# EAGLE design UltrasonicMatrix (EAGLE 9.4.2)
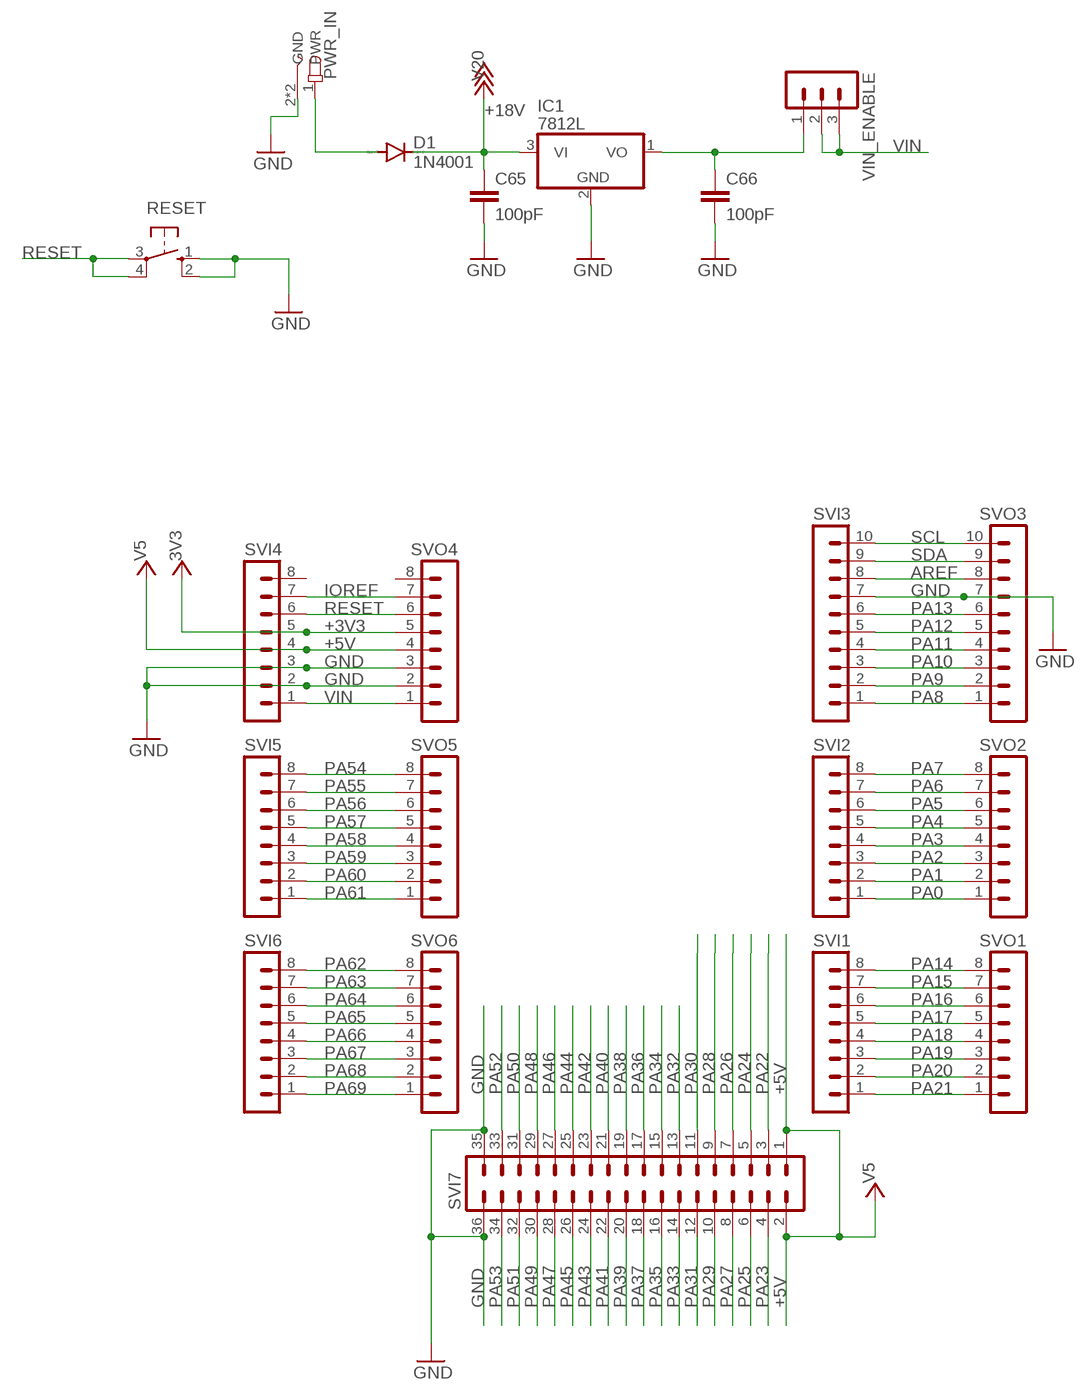
[diagram p0: schematic, sheet 1, part 1 of 2]
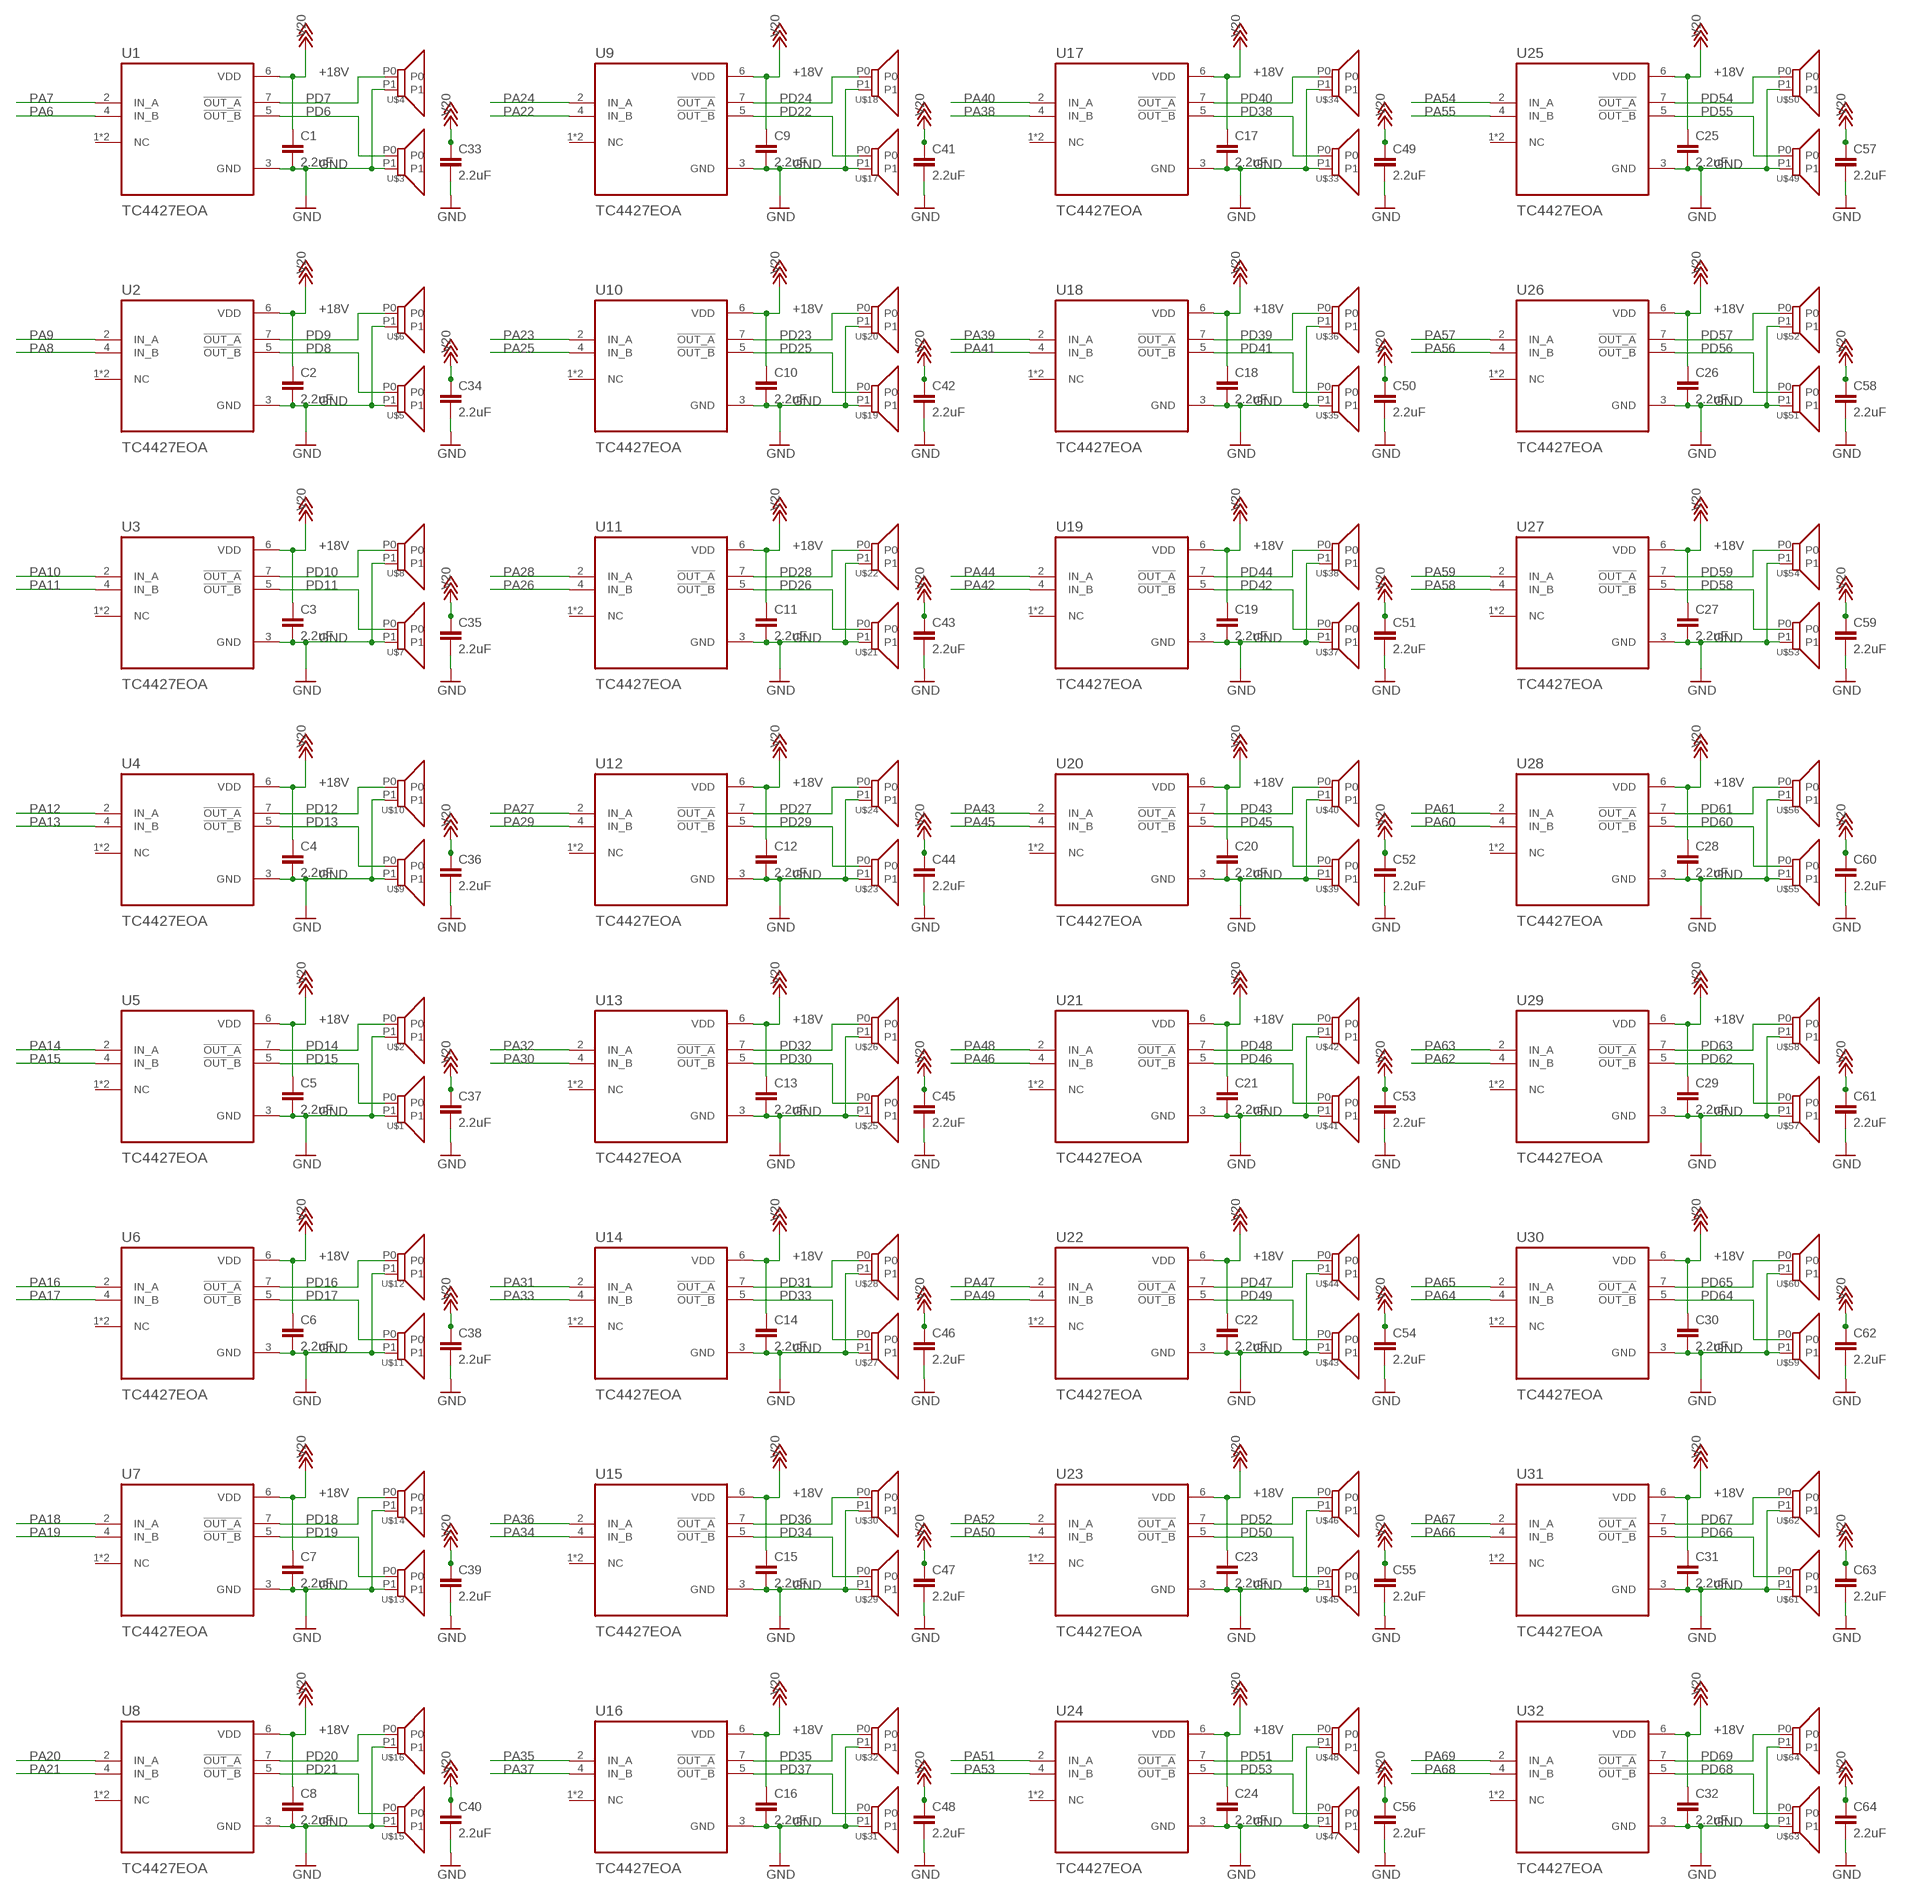
[diagram p1: schematic, sheet 1, part 2 of 2]

## Parts
C1  2.2uF  C-EUC1206  [C1206]
C2  2.2uF  C-EUC1206  [C1206]
C3  2.2uF  C-EUC1206  [C1206]
C4  2.2uF  C-EUC1206  [C1206]
C5  2.2uF  C-EUC1206  [C1206]
C6  2.2uF  C-EUC1206  [C1206]
C7  2.2uF  C-EUC1206  [C1206]
C8  2.2uF  C-EUC1206  [C1206]
C9  2.2uF  C-EUC1206  [C1206]
C10  2.2uF  C-EUC1206  [C1206]
C11  2.2uF  C-EUC1206  [C1206]
C12  2.2uF  C-EUC1206  [C1206]
C13  2.2uF  C-EUC1206  [C1206]
C14  2.2uF  C-EUC1206  [C1206]
C15  2.2uF  C-EUC1206  [C1206]
C16  2.2uF  C-EUC1206  [C1206]
C17  2.2uF  C-EUC1206  [C1206]
C18  2.2uF  C-EUC1206  [C1206]
C19  2.2uF  C-EUC1206  [C1206]
C20  2.2uF  C-EUC1206  [C1206]
C21  2.2uF  C-EUC1206  [C1206]
C22  2.2uF  C-EUC1206  [C1206]
C23  2.2uF  C-EUC1206  [C1206]
C24  2.2uF  C-EUC1206  [C1206]
C25  2.2uF  C-EUC1206  [C1206]
C26  2.2uF  C-EUC1206  [C1206]
C27  2.2uF  C-EUC1206  [C1206]
C28  2.2uF  C-EUC1206  [C1206]
C29  2.2uF  C-EUC1206  [C1206]
C30  2.2uF  C-EUC1206  [C1206]
C31  2.2uF  C-EUC1206  [C1206]
C32  2.2uF  C-EUC1206  [C1206]
C33  2.2uF  C-EUC1206  [C1206]
C34  2.2uF  C-EUC1206  [C1206]
C35  2.2uF  C-EUC1206  [C1206]
C36  2.2uF  C-EUC1206  [C1206]
C37  2.2uF  C-EUC1206  [C1206]
C38  2.2uF  C-EUC1206  [C1206]
C39  2.2uF  C-EUC1206  [C1206]
C40  2.2uF  C-EUC1206  [C1206]
C41  2.2uF  C-EUC1206  [C1206]
C42  2.2uF  C-EUC1206  [C1206]
C43  2.2uF  C-EUC1206  [C1206]
C44  2.2uF  C-EUC1206  [C1206]
C45  2.2uF  C-EUC1206  [C1206]
C46  2.2uF  C-EUC1206  [C1206]
C47  2.2uF  C-EUC1206  [C1206]
C48  2.2uF  C-EUC1206  [C1206]
C49  2.2uF  C-EUC1206  [C1206]
C50  2.2uF  C-EUC1206  [C1206]
C51  2.2uF  C-EUC1206  [C1206]
C52  2.2uF  C-EUC1206  [C1206]
C53  2.2uF  C-EUC1206  [C1206]
C54  2.2uF  C-EUC1206  [C1206]
C55  2.2uF  C-EUC1206  [C1206]
C56  2.2uF  C-EUC1206  [C1206]
C57  2.2uF  C-EUC1206  [C1206]
C58  2.2uF  C-EUC1206  [C1206]
C59  2.2uF  C-EUC1206  [C1206]
C60  2.2uF  C-EUC1206  [C1206]
C61  2.2uF  C-EUC1206  [C1206]
C62  2.2uF  C-EUC1206  [C1206]
C63  2.2uF  C-EUC1206  [C1206]
C64  2.2uF  C-EUC1206  [C1206]
C65  100pF  C-EU050-025X075  [C050-025X075]
C66  100pF  C-EU050-025X075  [C050-025X075]
D1  1N4001  1N4004  [DO41-10]
IC1  7812L  [TO92]
PWR_IN  DCJACK  [DCJACK]
RESET  10-XX  [B3F-10XX]
SVI1  MA08-1  [MA08-1]
SVI2  MA08-1  [MA08-1]
SVI3  MA10-1  [MA10-1]
SVI4  MA08-1  [MA08-1]
SVI5  MA08-1  [MA08-1]
SVI6  MA08-1  [MA08-1]
SVI7  MA18-2  [MA18-2]
SVO1  MA08-1  [MA08-1]
SVO2  MA08-1  [MA08-1]
SVO3  MA10-1  [MA10-1]
SVO4  MA08-1  [MA08-1]
SVO5  MA08-1  [MA08-1]
SVO6  MA08-1  [MA08-1]
U1  TC4427EOA  [SOIC127P599X175-8N]
U2  TC4427EOA  [SOIC127P599X175-8N]
U3  TC4427EOA  [SOIC127P599X175-8N]
U4  TC4427EOA  [SOIC127P599X175-8N]
U5  TC4427EOA  [SOIC127P599X175-8N]
U6  TC4427EOA  [SOIC127P599X175-8N]
U7  TC4427EOA  [SOIC127P599X175-8N]
U8  TC4427EOA  [SOIC127P599X175-8N]
U9  TC4427EOA  [SOIC127P599X175-8N]
U10  TC4427EOA  [SOIC127P599X175-8N]
U11  TC4427EOA  [SOIC127P599X175-8N]
U12  TC4427EOA  [SOIC127P599X175-8N]
U13  TC4427EOA  [SOIC127P599X175-8N]
U14  TC4427EOA  [SOIC127P599X175-8N]
U15  TC4427EOA  [SOIC127P599X175-8N]
U16  TC4427EOA  [SOIC127P599X175-8N]
U17  TC4427EOA  [SOIC127P599X175-8N]
U18  TC4427EOA  [SOIC127P599X175-8N]
U19  TC4427EOA  [SOIC127P599X175-8N]
U20  TC4427EOA  [SOIC127P599X175-8N]
U21  TC4427EOA  [SOIC127P599X175-8N]
U22  TC4427EOA  [SOIC127P599X175-8N]
U23  TC4427EOA  [SOIC127P599X175-8N]
U24  TC4427EOA  [SOIC127P599X175-8N]
U25  TC4427EOA  [SOIC127P599X175-8N]
U26  TC4427EOA  [SOIC127P599X175-8N]
U27  TC4427EOA  [SOIC127P599X175-8N]
U28  TC4427EOA  [SOIC127P599X175-8N]
U29  TC4427EOA  [SOIC127P599X175-8N]
U30  TC4427EOA  [SOIC127P599X175-8N]
U31  TC4427EOA  [SOIC127P599X175-8N]
U32  TC4427EOA  [SOIC127P599X175-8N]
U$1  TCT40-16  [TCT40-16]
U$2  TCT40-16  [TCT40-16]
U$3  TCT40-16  [TCT40-16]
U$4  TCT40-16  [TCT40-16]
U$5  TCT40-16  [TCT40-16]
U$6  TCT40-16  [TCT40-16]
U$7  TCT40-16  [TCT40-16]
U$8  TCT40-16  [TCT40-16]
U$9  TCT40-16  [TCT40-16]
U$10  TCT40-16  [TCT40-16]
U$11  TCT40-16  [TCT40-16]
U$12  TCT40-16  [TCT40-16]
U$13  TCT40-16  [TCT40-16]
U$14  TCT40-16  [TCT40-16]
U$15  TCT40-16  [TCT40-16]
U$16  TCT40-16  [TCT40-16]
U$17  TCT40-16  [TCT40-16]
U$18  TCT40-16  [TCT40-16]
U$19  TCT40-16  [TCT40-16]
U$20  TCT40-16  [TCT40-16]
U$21  TCT40-16  [TCT40-16]
U$22  TCT40-16  [TCT40-16]
U$23  TCT40-16  [TCT40-16]
U$24  TCT40-16  [TCT40-16]
U$25  TCT40-16  [TCT40-16]
U$26  TCT40-16  [TCT40-16]
U$27  TCT40-16  [TCT40-16]
U$28  TCT40-16  [TCT40-16]
U$29  TCT40-16  [TCT40-16]
U$30  TCT40-16  [TCT40-16]
U$31  TCT40-16  [TCT40-16]
U$32  TCT40-16  [TCT40-16]
U$33  TCT40-16  [TCT40-16]
U$34  TCT40-16  [TCT40-16]
U$35  TCT40-16  [TCT40-16]
U$36  TCT40-16  [TCT40-16]
U$37  TCT40-16  [TCT40-16]
U$38  TCT40-16  [TCT40-16]
U$39  TCT40-16  [TCT40-16]
U$40  TCT40-16  [TCT40-16]
U$41  TCT40-16  [TCT40-16]
U$42  TCT40-16  [TCT40-16]
U$43  TCT40-16  [TCT40-16]
U$44  TCT40-16  [TCT40-16]
U$45  TCT40-16  [TCT40-16]
U$46  TCT40-16  [TCT40-16]
U$47  TCT40-16  [TCT40-16]
U$48  TCT40-16  [TCT40-16]
U$49  TCT40-16  [TCT40-16]
U$50  TCT40-16  [TCT40-16]
U$51  TCT40-16  [TCT40-16]
U$52  TCT40-16  [TCT40-16]
U$53  TCT40-16  [TCT40-16]
U$54  TCT40-16  [TCT40-16]
U$55  TCT40-16  [TCT40-16]
U$56  TCT40-16  [TCT40-16]
U$57  TCT40-16  [TCT40-16]
U$58  TCT40-16  [TCT40-16]
U$59  TCT40-16  [TCT40-16]
U$60  TCT40-16  [TCT40-16]
U$61  TCT40-16  [TCT40-16]
U$62  TCT40-16  [TCT40-16]
U$63  TCT40-16  [TCT40-16]
U$64  TCT40-16  [TCT40-16]
VIN_ENABLE  MA03-1  [MA03-1]

## Nets
+3V3 [+3V3]: SVI4.5 SVO4.5 ; supply symbol labelled 3V3
+5V [+5V]: SVI4.4 SVI7.1 SVI7.2 SVO4.4 ; supply symbol labelled V5
+18V [+18V]: C1.1 C2.1 C3.1 C4.1 C5.1 C6.1 C7.1 C8.1 C9.1 C10.1 C11.1 C12.1 C13.1 C14.1 C15.1 C16.1 C17.1 C18.1 C19.1 C20.1 C21.1 C22.1 C23.1 C24.1 C25.1 C26.1 C27.1 C28.1 C29.1 C30.1 C31.1 C32.1 C33.1 C34.1 C35.1 C36.1 C37.1 C38.1 C39.1 C40.1 C41.1 C42.1 C43.1 C44.1 C45.1 C46.1 C47.1 C48.1 C49.1 C50.1 C51.1 C52.1 C53.1 C54.1 C55.1 C56.1 C57.1 C58.1 C59.1 C60.1 C61.1 C62.1 C63.1 C64.1 C65.1 D1.C IC1.3(VI) U1.6(VDD) U2.6(VDD) U3.6(VDD) U4.6(VDD) U5.6(VDD) U6.6(VDD) U7.6(VDD) U8.6(VDD) U9.6(VDD) U10.6(VDD) U11.6(VDD) U12.6(VDD) U13.6(VDD) U14.6(VDD) U15.6(VDD) U16.6(VDD) U17.6(VDD) U18.6(VDD) U19.6(VDD) U20.6(VDD) U21.6(VDD) U22.6(VDD) U23.6(VDD) U24.6(VDD) U25.6(VDD) U26.6(VDD) U27.6(VDD) U28.6(VDD) U29.6(VDD) U30.6(VDD) U31.6(VDD) U32.6(VDD) ; supply symbol labelled V20
AREF: SVI3.8 SVO3.8
GND [GND]: C1.2 C2.2 C3.2 C4.2 C5.2 C6.2 C7.2 C8.2 C9.2 C10.2 C11.2 C12.2 C13.2 C14.2 C15.2 C16.2 C17.2 C18.2 C19.2 C20.2 C21.2 C22.2 C23.2 C24.2 C25.2 C26.2 C27.2 C28.2 C29.2 C30.2 C31.2 C32.2 C33.2 C34.2 C35.2 C36.2 C37.2 C38.2 C39.2 C40.2 C41.2 C42.2 C43.2 C44.2 C45.2 C46.2 C47.2 C48.2 C49.2 C50.2 C51.2 C52.2 C53.2 C54.2 C55.2 C56.2 C57.2 C58.2 C59.2 C60.2 C61.2 C62.2 C63.2 C64.2 C65.2 C66.2 IC1.2(GND) PWR_IN.2(GND) PWR_IN.3(GND) RESET.1(S) RESET.2(S1) SVI3.7 SVI4.2 SVI4.3 SVI7.35 SVI7.36 SVO3.7 SVO4.2 SVO4.3 U1.3(GND) U2.3(GND) U3.3(GND) U4.3(GND) U5.3(GND) U6.3(GND) U7.3(GND) U8.3(GND) U9.3(GND) U10.3(GND) U11.3(GND) U12.3(GND) U13.3(GND) U14.3(GND) U15.3(GND) U16.3(GND) U17.3(GND) U18.3(GND) U19.3(GND) U20.3(GND) U21.3(GND) U22.3(GND) U23.3(GND) U24.3(GND) U25.3(GND) U26.3(GND) U27.3(GND) U28.3(GND) U29.3(GND) U30.3(GND) U31.3(GND) U32.3(GND) U$1.P1 U$2.P1 U$3.P1 U$4.P1 U$5.P1 U$6.P1 U$7.P1 U$8.P1 U$9.P1 U$10.P1 U$11.P1 U$12.P1 U$13.P1 U$14.P1 U$15.P1 U$16.P1 U$17.P1 U$18.P1 U$19.P1 U$20.P1 U$21.P1 U$22.P1 U$23.P1 U$24.P1 U$25.P1 U$26.P1 U$27.P1 U$28.P1 U$29.P1 U$30.P1 U$31.P1 U$32.P1 U$33.P1 U$34.P1 U$35.P1 U$36.P1 U$37.P1 U$38.P1 U$39.P1 U$40.P1 U$41.P1 U$42.P1 U$43.P1 U$44.P1 U$45.P1 U$46.P1 U$47.P1 U$48.P1 U$49.P1 U$50.P1 U$51.P1 U$52.P1 U$53.P1 U$54.P1 U$55.P1 U$56.P1 U$57.P1 U$58.P1 U$59.P1 U$60.P1 U$61.P1 U$62.P1 U$63.P1 U$64.P1
IOREF: SVI4.7 SVO4.7
N$1: D1.A PWR_IN.1(PWR)
N$4 [+12V]: C66.1 IC1.1(VO) VIN_ENABLE.1
PA0: SVI2.1 SVO2.1
PA1: SVI2.2 SVO2.2
PA2: SVI2.3 SVO2.3
PA3: SVI2.4 SVO2.4
PA4: SVI2.5 SVO2.5
PA5: SVI2.6 SVO2.6
PA6: SVI2.7 SVO2.7 U1.4(IN_B)
PA7: SVI2.8 SVO2.8 U1.2(IN_A)
PA8: SVI3.1 SVO3.1 U2.4(IN_B)
PA9: SVI3.2 SVO3.2 U2.2(IN_A)
PA10: SVI3.3 SVO3.3 U3.2(IN_A)
PA11: SVI3.4 SVO3.4 U3.4(IN_B)
PA12: SVI3.5 SVO3.5 U4.2(IN_A)
PA13: SVI3.6 SVO3.6 U4.4(IN_B)
PA14: SVI1.8 SVO1.8 U5.2(IN_A)
PA15: SVI1.7 SVO1.7 U5.4(IN_B)
PA16: SVI1.6 SVO1.6 U6.2(IN_A)
PA17: SVI1.5 SVO1.5 U6.4(IN_B)
PA18: SVI1.4 SVO1.4 U7.2(IN_A)
PA19: SVI1.3 SVO1.3 U7.4(IN_B)
PA20: SVI1.2 SVO1.2 U8.2(IN_A)
PA21: SVI1.1 SVO1.1 U8.4(IN_B)
PA22: SVI7.3 U9.4(IN_B)
PA23: SVI7.4 U10.2(IN_A)
PA24: SVI7.5 U9.2(IN_A)
PA25: SVI7.6 U10.4(IN_B)
PA26: SVI7.7 U11.4(IN_B)
PA27: SVI7.8 U12.2(IN_A)
PA28: SVI7.9 U11.2(IN_A)
PA29: SVI7.10 U12.4(IN_B)
PA30: SVI7.11 U13.4(IN_B)
PA31: SVI7.12 U14.2(IN_A)
PA32: SVI7.13 U13.2(IN_A)
PA33: SVI7.14 U14.4(IN_B)
PA34: SVI7.15 U15.4(IN_B)
PA35: SVI7.16 U16.2(IN_A)
PA36: SVI7.17 U15.2(IN_A)
PA37: SVI7.18 U16.4(IN_B)
PA38: SVI7.19 U17.4(IN_B)
PA39: SVI7.20 U18.2(IN_A)
PA40: SVI7.21 U17.2(IN_A)
PA41: SVI7.22 U18.4(IN_B)
PA42: SVI7.23 U19.4(IN_B)
PA43: SVI7.24 U20.2(IN_A)
PA44: SVI7.25 U19.2(IN_A)
PA45: SVI7.26 U20.4(IN_B)
PA46: SVI7.27 U21.4(IN_B)
PA47: SVI7.28 U22.2(IN_A)
PA48: SVI7.29 U21.2(IN_A)
PA49: SVI7.30 U22.4(IN_B)
PA50: SVI7.31 U23.4(IN_B)
PA51: SVI7.32 U24.2(IN_A)
PA52: SVI7.33 U23.2(IN_A)
PA53: SVI7.34 U24.4(IN_B)
PA54: SVI5.8 SVO5.8 U25.2(IN_A)
PA55: SVI5.7 SVO5.7 U25.4(IN_B)
PA56: SVI5.6 SVO5.6 U26.4(IN_B)
PA57: SVI5.5 SVO5.5 U26.2(IN_A)
PA58: SVI5.4 SVO5.4 U27.4(IN_B)
PA59: SVI5.3 SVO5.3 U27.2(IN_A)
PA60: SVI5.2 SVO5.2 U28.4(IN_B)
PA61: SVI5.1 SVO5.1 U28.2(IN_A)
PA62: SVI6.8 SVO6.8 U29.4(IN_B)
PA63: SVI6.7 SVO6.7 U29.2(IN_A)
PA64: SVI6.6 SVO6.6 U30.4(IN_B)
PA65: SVI6.5 SVO6.5 U30.2(IN_A)
PA66: SVI6.4 SVO6.4 U31.4(IN_B)
PA67: SVI6.3 SVO6.3 U31.2(IN_A)
PA68: SVI6.2 SVO6.2 U32.4(IN_B)
PA69: SVI6.1 SVO6.1 U32.2(IN_A)
PD6 [DRV]: U1.5(!OUT_B) U$3.P0
PD7 [DRV]: U1.7(!OUT_A) U$4.P0
PD8 [DRV]: U2.5(!OUT_B) U$5.P0
PD9 [DRV]: U2.7(!OUT_A) U$6.P0
PD10 [DRV]: U3.7(!OUT_A) U$8.P0
PD11 [DRV]: U3.5(!OUT_B) U$7.P0
PD12 [DRV]: U4.7(!OUT_A) U$10.P0
PD13 [DRV]: U4.5(!OUT_B) U$9.P0
PD14 [DRV]: U5.7(!OUT_A) U$2.P0
PD15 [DRV]: U5.5(!OUT_B) U$1.P0
PD16 [DRV]: U6.7(!OUT_A) U$12.P0
PD17 [DRV]: U6.5(!OUT_B) U$11.P0
PD18 [DRV]: U7.7(!OUT_A) U$14.P0
PD19 [DRV]: U7.5(!OUT_B) U$13.P0
PD20 [DRV]: U8.7(!OUT_A) U$16.P0
PD21 [DRV]: U8.5(!OUT_B) U$15.P0
PD22 [DRV]: U9.5(!OUT_B) U$17.P0
PD23 [DRV]: U10.7(!OUT_A) U$20.P0
PD24 [DRV]: U9.7(!OUT_A) U$18.P0
PD25 [DRV]: U10.5(!OUT_B) U$19.P0
PD26 [DRV]: U11.5(!OUT_B) U$21.P0
PD27 [DRV]: U12.7(!OUT_A) U$24.P0
PD28 [DRV]: U11.7(!OUT_A) U$22.P0
PD29 [DRV]: U12.5(!OUT_B) U$23.P0
PD30 [DRV]: U13.5(!OUT_B) U$25.P0
PD31 [DRV]: U14.7(!OUT_A) U$28.P0
PD32 [DRV]: U13.7(!OUT_A) U$26.P0
PD33 [DRV]: U14.5(!OUT_B) U$27.P0
PD34 [DRV]: U15.5(!OUT_B) U$29.P0
PD35 [DRV]: U16.7(!OUT_A) U$32.P0
PD36 [DRV]: U15.7(!OUT_A) U$30.P0
PD37 [DRV]: U16.5(!OUT_B) U$31.P0
PD38 [DRV]: U17.5(!OUT_B) U$33.P0
PD39 [DRV]: U18.7(!OUT_A) U$36.P0
PD40 [DRV]: U17.7(!OUT_A) U$34.P0
PD41 [DRV]: U18.5(!OUT_B) U$35.P0
PD42 [DRV]: U19.5(!OUT_B) U$37.P0
PD43 [DRV]: U20.7(!OUT_A) U$40.P0
PD44 [DRV]: U19.7(!OUT_A) U$38.P0
PD45 [DRV]: U20.5(!OUT_B) U$39.P0
PD46 [DRV]: U21.5(!OUT_B) U$41.P0
PD47 [DRV]: U22.7(!OUT_A) U$44.P0
PD48 [DRV]: U21.7(!OUT_A) U$42.P0
PD49 [DRV]: U22.5(!OUT_B) U$43.P0
PD50 [DRV]: U23.5(!OUT_B) U$45.P0
PD51 [DRV]: U24.7(!OUT_A) U$48.P0
PD52 [DRV]: U23.7(!OUT_A) U$46.P0
PD53 [DRV]: U24.5(!OUT_B) U$47.P0
PD54 [DRV]: U25.7(!OUT_A) U$50.P0
PD55 [DRV]: U25.5(!OUT_B) U$49.P0
PD56 [DRV]: U26.5(!OUT_B) U$51.P0
PD57 [DRV]: U26.7(!OUT_A) U$52.P0
PD58 [DRV]: U27.5(!OUT_B) U$53.P0
PD59 [DRV]: U27.7(!OUT_A) U$54.P0
PD60 [DRV]: U28.5(!OUT_B) U$55.P0
PD61 [DRV]: U28.7(!OUT_A) U$56.P0
PD62 [DRV]: U29.5(!OUT_B) U$57.P0
PD63 [DRV]: U29.7(!OUT_A) U$58.P0
PD64 [DRV]: U30.5(!OUT_B) U$59.P0
PD65 [DRV]: U30.7(!OUT_A) U$60.P0
PD66 [DRV]: U31.5(!OUT_B) U$61.P0
PD67 [DRV]: U31.7(!OUT_A) U$62.P0
PD68 [DRV]: U32.5(!OUT_B) U$63.P0
PD69 [DRV]: U32.7(!OUT_A) U$64.P0
RESET: RESET.3(P) RESET.4(P1) SVI4.6 SVO4.6
SCL: SVI3.10 SVO3.10
SDA: SVI3.9 SVO3.9
VIN [+12V]: SVI4.1 SVO4.1 VIN_ENABLE.2 VIN_ENABLE.3
Unconnected: SVI4.8 SVO4.8 U1.1(NC) U1.8(NC) U2.1(NC) U2.8(NC) U3.1(NC) U3.8(NC) U4.1(NC) U4.8(NC) U5.1(NC) U5.8(NC) U6.1(NC) U6.8(NC) U7.1(NC) U7.8(NC) U8.1(NC) U8.8(NC) U9.1(NC) U9.8(NC) U10.1(NC) U10.8(NC) U11.1(NC) U11.8(NC) U12.1(NC) U12.8(NC) U13.1(NC) U13.8(NC) U14.1(NC) U14.8(NC) U15.1(NC) U15.8(NC) U16.1(NC) U16.8(NC) U17.1(NC) U17.8(NC) U18.1(NC) U18.8(NC) U19.1(NC) U19.8(NC) U20.1(NC) U20.8(NC) U21.1(NC) U21.8(NC) U22.1(NC) U22.8(NC) U23.1(NC) U23.8(NC) U24.1(NC) U24.8(NC) U25.1(NC) U25.8(NC) U26.1(NC) U26.8(NC) U27.1(NC) U27.8(NC) U28.1(NC) U28.8(NC) U29.1(NC) U29.8(NC) U30.1(NC) U30.8(NC) U31.1(NC) U31.8(NC) U32.1(NC) U32.8(NC)

## Library data of the parts
C1-C66 = rcl:C-EU: CAPACITOR, European symbol; SPICEPREFIX: C
D1 = diode:1N4004: DIODE general purpose rectifier, 1 A
IC1 = linear:78*: Positive VOLTAGE REGULATOR Source: http://cache.national.com/ds/LM/LM78L05.pdf http://www.fairchildsemi.com/ds/LM/LM7805.pdf
PWR_IN = DCJack:DCJACK
RESET = switch-omron:10-XX: OMRON SWITCH; MPN: B3F-1000; OC_FARNELL: 176432; OC_NEWARK: 36M3542
SVI1 SVI2 SVI4-SVI6 SVO1 SVO2 SVO4-SVO6 = con-lstb:MA08-1: PIN HEADER; OC_FARNELL: unknown; OC_NEWARK: unknown
SVI3 SVO3 = con-lstb:MA10-1: PIN HEADER; OC_FARNELL: unknown; OC_NEWARK: unknown
SVI7 = con-lstb:MA18-2: PIN HEADER; OC_FARNELL: unknown; OC_NEWARK: unknown
U1-U32 = TC4427EOA:TC4427EOA; AVAILABILITY: Unavailable; DESCRIPTION: Low-Side Gate Driver IC Non-Inverting 8-SOIC; MF: Microchip; MP: TC4427EOA; PACKAGE: SOIC-8 Microchip; PRICE: None
U$1-U$64 = TCT40:TCT40-16: TCT40-16 T/R Ultrasonic transducer. 40kHz. Diameter: 16mm
VIN_ENABLE = con-lstb:MA03-1: PIN HEADER; OC_FARNELL: unknown; OC_NEWARK: unknown

## Net classes
0 default: width 0.508 mm, drill 0.254 mm, clearance 0.205 mm
1 +18V: width 0.762 mm
2 +5V: width 1.27 mm
3 +3V3: width 1.27 mm
4 DRV: width 0.762 mm
5 GND: width 0.762 mm
6 +12V: width 1.016 mm

## Board
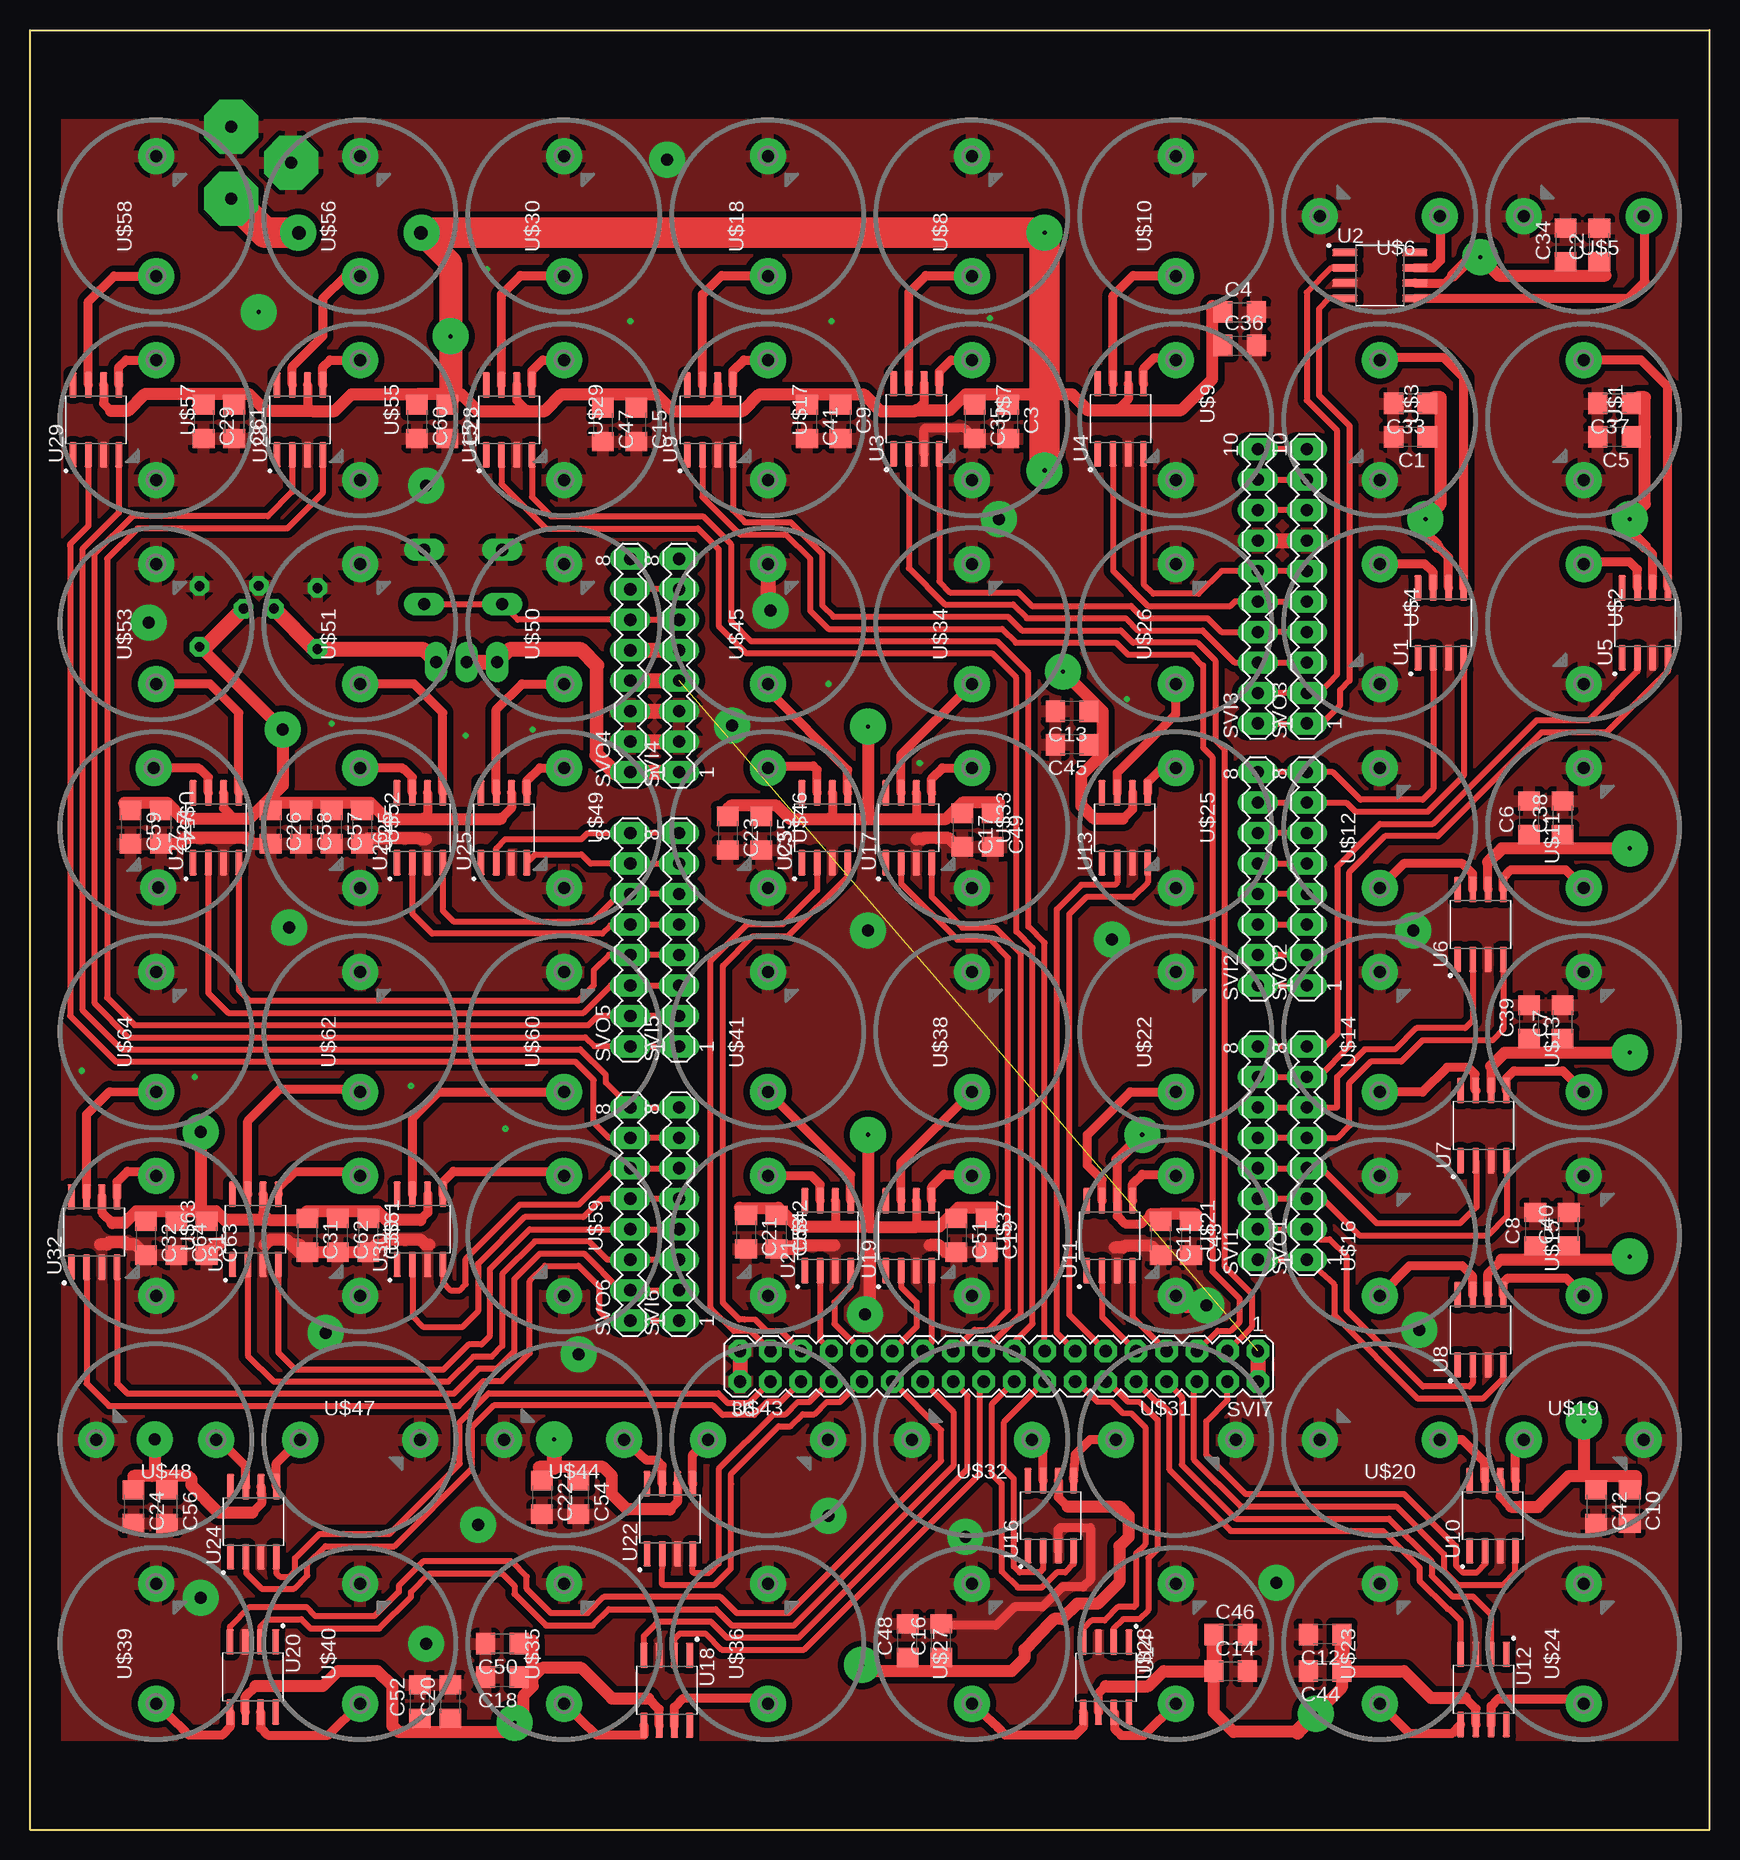
[diagram p2: board, top side]
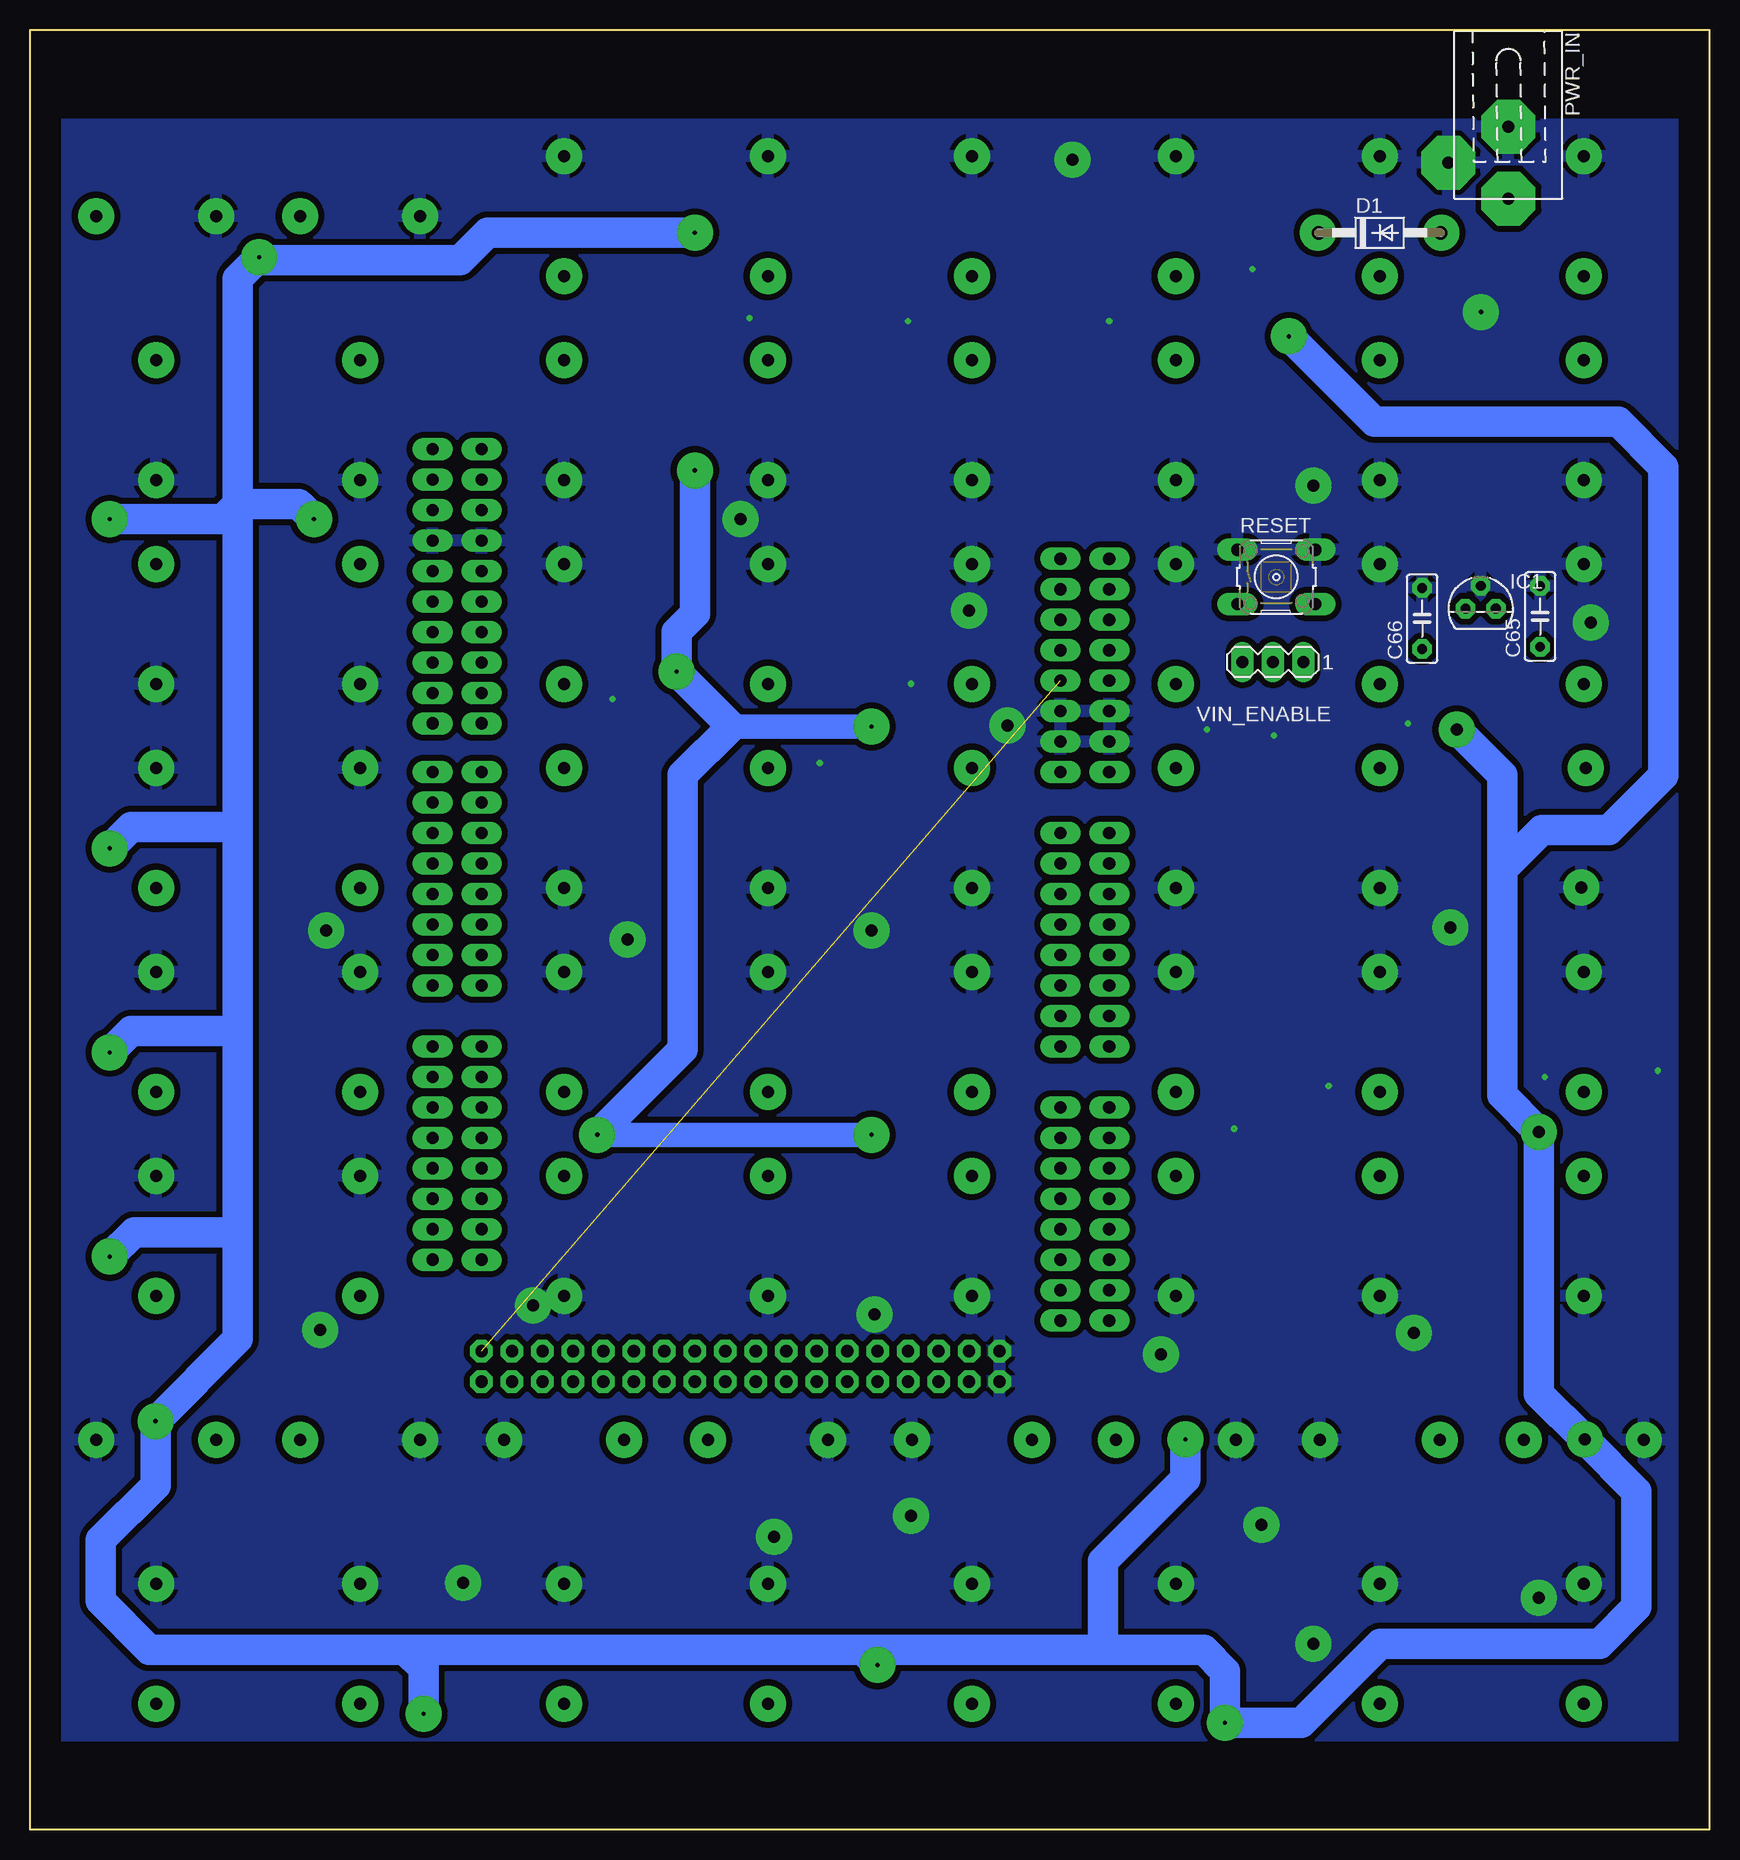
[diagram p3: board, bottom side, seen from below]

Size 140 x 150 mm. Coordinates in mm from the lower left corner, seen from the top.
Outline: 0,0 0,150 140,150 140,0 0,0
Copper layers (1*16): Top 0.035mm / dielectric 1.5mm / Bottom 0.035mm
Design rules "UltrasonicMatrix": minimum track width 18mil, minimum drill 0.1mm, track to track 20mil, track to pad 20mil, pad to pad 20mil, via to via 20mil, smd to smd 20mil, copper to edge 2.5mm, drill to drill 1mm, minimum pad ring 10mil, minimum via ring 10mil, stop-mask expansion 3mil, vias tented up to drill 0mil, thermal gap 16mil

### Footprints (pad centres in the part's own frame; a part is rotated, then mirrored left to right if it is on the bottom)
C1206 = smd 1.6 x 1.8: 1 -1.4,0; 2 1.4,0
C050-025X075 = drill 0.813 octagon: 1 -2.54,0; 2 2.54,0
DO41-10 = drill 1.118: A 5.08,0; C -5.08,0
TO92 = drill 0.813 octagon: 1 -1.27,0; 2 0,1.905; 3 1.27,0
DCJACK = drill 1 pad 4.5 octagon: 1 0,-3; 2 0,3; 3 -5,0
B3F-10XX = drill 1.016 long: 1 -3.251,2.261; 2 3.251,2.261; 3 -3.251,-2.261; 4 3.251,-2.261
MA08-1 = drill 1.016 long: 1 -8.89,0; 2 -6.35,0; 3 -3.81,0; 4 -1.27,0; 5 1.27,0; 6 3.81,0; 7 6.35,0; 8 8.89,0
MA10-1 = drill 1.016 long: 1 -11.43,0; 2 -8.89,0; 3 -6.35,0; 4 -3.81,0; 5 -1.27,0; 6 1.27,0; 7 3.81,0; 8 6.35,0; 9 8.89,0; 10 11.43,0
MA18-2 = drill 1.016 octagon: 1 -21.59,-1.27; 2 -21.59,1.27; 3 -19.05,-1.27; 4 -19.05,1.27; 5 -16.51,-1.27; 6 -16.51,1.27; 7 -13.97,-1.27; 8 -13.97,1.27; 9 -11.43,-1.27; 10 -11.43,1.27; 11 -8.89,-1.27; 12 -8.89,1.27; 13 -6.35,-1.27; 14 -6.35,1.27; 15 -3.81,-1.27; 16 -3.81,1.27; 17 -1.27,-1.27; 18 -1.27,1.27; 19 1.27,-1.27; 20 1.27,1.27; 21 3.81,-1.27; 22 3.81,1.27; 23 6.35,-1.27; 24 6.35,1.27; 25 8.89,-1.27; 26 8.89,1.27; 27 11.43,-1.27; 28 11.43,1.27; 29 13.97,-1.27; 30 13.97,1.27; 31 16.51,-1.27; 32 16.51,1.27; 33 19.05,-1.27; 34 19.05,1.27; 35 21.59,-1.27; 36 21.59,1.27
SOIC127P599X175-8N = smd 2.088 x 0.6: 1 -2.924,1.905; 2 -2.924,0.635; 3 -2.924,-0.635; 4 -2.924,-1.905; 5 2.924,-1.905; 6 2.924,-0.635; 7 2.924,0.635; 8 2.924,1.905
TCT40-16 = drill 1 pad 3: P0 -5,0; P1 5,0
MA03-1 = drill 1.016 long: 1 -2.54,0; 2 0,0; 3 2.54,0

### Placement (x,y rotation side)
C1  115.06,116.08 180 top
C2  130.81,132.08 90 top
C3  81.53,117.35 270 top
C4  100.84,126.49 0 top
C5  132.08,116.08 180 top
C6  124.97,84.33 90 top
C7  127.76,67.31 90 top
C8  125.48,50.04 90 top
C9  67.56,117.35 270 top
C10  133.35,26.92 270 top
C11  94.23,49.28 270 top
C12  107.95,16.26 180 top
C13  86.87,93.22 180 top
C14  100.08,13.21 0 top
C15  50.55,117.09 270 top
C16  75.95,15.75 90 top
C17  77.72,83.31 270 top
C18  39.37,12.7 180 top
C19  79.76,49.53 270 top
C20  35.05,10.67 90 top
C21  59.69,49.78 270 top
C22  42.67,27.69 270 top
C23  58.17,83.06 270 top
C24  8.64,26.92 270 top
C25  27.69,83.57 270 top
C26  20.07,83.57 270 top
C27  10.92,83.57 270 top
C28  34.8,117.35 270 top
C29  14.48,117.35 270 top
C30  28.19,49.53 270 top
C31  23.11,49.53 270 top
C32  9.65,49.28 270 top
C33  115.06,118.87 180 top
C34  128.02,132.08 90 top
C35  78.74,117.35 270 top
C36  100.84,123.7 0 top
C37  132.08,118.87 180 top
C38  127.76,84.33 90 top
C39  124.97,67.31 90 top
C40  128.27,50.04 90 top
C41  64.77,117.35 270 top
C42  130.56,26.92 270 top
C43  96.77,49.28 270 top
C44  107.95,13.21 180 top
C45  86.87,90.42 180 top
C46  100.08,16.26 0 top
C47  47.75,117.09 270 top
C48  73.15,15.75 90 top
C49  80.26,83.31 270 top
C50  39.37,15.49 180 top
C51  77.22,49.53 270 top
C52  32.51,10.67 90 top
C53  62.23,49.78 270 top
C54  45.72,27.69 270 top
C55  60.96,83.06 270 top
C56  11.43,26.92 270 top
C57  25.15,83.57 270 top
C58  22.61,83.57 270 top
C59  8.38,83.57 270 top
C60  32.26,117.35 270 top
C61  17.02,117.35 270 top
C62  25.65,49.53 270 top
C63  14.73,49.28 270 top
C64  12.19,49.28 270 top
C65  14.12,101.11 90 bottom
C66  23.95,100.94 90 bottom
D1  27.49,133.1 0 bottom
IC1  19.07,101.77 0 bottom
PWR_IN  16.76,138.94 0 bottom
RESET  36.11,104.41 0 bottom
SVI1  102.36,56.39 90 top
SVI2  102.36,79.25 90 top
SVI3  102.36,103.63 90 top
SVI4  54.1,97.03 90 top
SVI5  54.1,74.17 90 top
SVI6  54.1,51.31 90 top
SVI7  80.77,38.61 180 top
SVO1  106.43,56.39 90 top
SVO2  106.43,79.25 90 top
SVO3  106.43,103.63 90 top
SVO4  50.04,97.03 90 top
SVO5  50.04,74.17 90 top
SVO6  50.04,51.31 90 top
U1  117.6,100.58 90 top
U2  112.52,129.54 0 top
U3  73.89,117.59 90 top
U4  90.91,117.59 90 top
U5  134.62,100.58 90 top
U6  120.9,75.44 90 top
U7  121.16,58.67 90 top
U8  120.9,41.66 90 top
U9  56.69,117.5 90 top
U10  121.92,26.16 90 top
U11  89.99,49.5 90 top
U12  121.16,11.68 270 top
U13  91.26,83.5 90 top
U14  89.7,12.7 270 top
U15  39.94,117.5 90 top
U16  85.09,26.16 90 top
U17  73.25,83.5 90 top
U18  53.09,11.6 270 top
U19  73.25,49.5 90 top
U20  18.58,12.72 270 top
U21  66.5,49.5 90 top
U22  53.34,25.91 90 top
U23  66.25,83.5 90 top
U24  18.63,25.66 90 top
U25  39.5,83.5 90 top
U26  32.5,83.5 90 top
U27  15.5,83.5 90 top
U28  22.5,117.5 90 top
U29  5.5,117.5 90 top
U30  32.51,50.04 90 top
U31  18.8,50.04 90 top
U32  5.36,49.81 90 top
U$1  129.5,117.5 270 top
U$2  129.5,100.5 270 top
U$3  112.5,117.5 270 top
U$4  112.5,100.5 270 top
U$5  129.5,134.5 180 top
U$6  112.5,134.5 180 top
U$7  78.5,117.5 270 top
U$8  78.5,134.5 90 top
U$9  95.5,117.5 270 top
U$10  95.5,134.5 90 top
U$11  129.5,83.5 90 top
U$12  112.5,83.5 90 top
U$13  129.5,66.5 90 top
U$14  112.5,66.5 90 top
U$15  129.5,49.5 90 top
U$16  112.5,49.5 90 top
U$17  61.5,117.5 270 top
U$18  61.5,134.5 90 top
U$19  129.5,32.5 0 top
U$20  112.5,32.5 180 top
U$21  95.5,49.5 270 top
U$22  95.5,66.5 90 top
U$23  112.5,15.5 90 top
U$24  129.5,15.5 90 top
U$25  95.5,83.5 270 top
U$26  95.5,100.5 90 top
U$27  78.5,15.5 90 top
U$28  95.5,15.5 90 top
U$29  44.5,117.5 270 top
U$30  44.5,134.5 90 top
U$31  95.5,32.5 0 top
U$32  78.5,32.5 180 top
U$33  78.5,83.5 270 top
U$34  78.5,100.5 90 top
U$35  44.5,15.5 90 top
U$36  61.5,15.5 90 top
U$37  78.5,49.5 270 top
U$38  78.5,66.5 90 top
U$39  10.5,15.5 90 top
U$40  27.5,15.5 90 top
U$41  61.5,66.5 90 top
U$42  61.5,49.5 270 top
U$43  61.5,32.5 0 top
U$44  44.5,32.5 180 top
U$45  61.5,100.5 90 top
U$46  61.5,83.5 270 top
U$47  27.5,32.5 0 top
U$48  10.5,32.5 180 top
U$49  44.5,83.5 270 top
U$50  44.5,100.5 90 top
U$51  27.5,100.5 90 top
U$52  27.5,83.5 270 top
U$53  10.5,100.5 90 top
U$54  10.5,83.5 272.2 top
U$55  27.5,117.5 270 top
U$56  27.5,134.5 90 top
U$57  10.5,117.5 270 top
U$58  10.5,134.5 90 top
U$59  44.5,49.5 270 top
U$60  44.5,66.5 90 top
U$61  27.5,49.5 270 top
U$62  27.5,66.5 90 top
U$63  10.5,49.5 270 top
U$64  10.5,66.5 90 top
VIN_ENABLE  36.39,97.32 180 bottom

### Tracks (layer width: path | path; a pad name or v marks a point on that pad's centre or on a via)
+3V3
  Top 1.27: SVO4.5 SVI4.5
+5V  (1 unrouted)
  Top 1.27: SVI7.1 SVI7.2 | SVO4.4 SVI4.4
+18V  (via drill 0.35 pad 3, 1 pad 3)
  Top 0.762: U18.6 52.45,10.03 51.56,10.92 | U24.6 19.27,28.06 19.3,28.02 19.3,27.18 18.52,26.4 | 16.36,26.4 16.34,26.42 | U16.6 85.72,27.7 86.5,26.92 | 123.45,26.9 122.56,27.8 U10.6 | U20.6 17.94,11.09 18.8,11.94 | U14.6 89.06,11.34 89.66,11.94 | 93.47,51.31 92.66,50.49 91.27,50.49 90.63,51.14 U11.6 90.63,55.83 | U21.6 67.14,50.57 66.8,50.24 | U19.6 73.88,50.24 | U13.6 91.9,85.04 91.09,84.24 | U8.6 121.54,46.35 122.68,47.5 | U7.6 121.79,63.63 | U6.6 121.54,80.64 | U1.6 118.24,106.05 117.35,106.93 | U5.6 135.25,106.3 134.62,106.93 | U2.6 117.98,128.91 118.62,129.54 | U15.6 40.58,119.14 41.48,118.24 | U4.6 91.54,119.23 90.64,118.33 | U3.6 74.53,118.94 73.91,118.33 73.82,118.24 | U9.6 57.33,118.92 56.64,118.24 | U32.6 5.99,51.45 6.89,50.55 | U30.6 33.15,51.42 32.52,50.8 | U31.6 19.43,51.43 20.07,50.8 | 10.41,29.72 10.16,29.46 | U25.6 40.13,85.14 39.24,84.24 | U27.6 16.14,85.14 17.04,84.24 | U26.6 33.13,84.63 32.75,84.24 | U29.6 6.13,118.86 6.76,118.24 | U28.6 23.14,118.6 23.5,118.24 | U23.6 66.88,84.57 66.55,84.24 | U17.6 73.88,84.46 73.66,84.24 | U22.6 53.98,27.3 53.34,26.67 | U12.6 120.52,10.06 119.63,10.96 | 124.19,26.9 124.36,26.9 124.36,26.89
  Top 1.016: 51.56,10.92 48.51,10.92 45.97,13.46 42.67,13.46 41.91,12.7 | 86.5,26.92 90.81,26.92 91.57,26.16 91.57,24.37 90.81,23.61 90.81,20.62 89.02,18.83 87.3,18.83 86.03,17.56 85.37,17.56 83.86,16.04 83.86,15.97 82.88,14.99 82.88,14.26 81.83,13.21 76.2,13.21 | 53.34,26.67 49.78,26.67 48.51,27.94 48.51,29.46 47.75,30.23 45.47,30.23 | 45.47,30.23 43.69,30.23 42.42,30.23 42.42,29.34 C22.1 | 119.63,10.96 116.81,10.96 114.55,13.21 C44.1 109.35,11.81 v107.19,9.65 | 124.36,26.89 125.7,26.89 128.27,29.46 129.54,29.46 | 129.54,29.46 130.56,29.46 | 130.56,29.46 133.86,29.46 133.86,28.83 C10.1 | 16.34,26.42 15.75,26.42 13.46,28.7 13.46,29.21 13.21,29.46 11.43,29.46 | 18.52,26.4 16.36,26.4 | 123.45,26.9 124.19,26.9 | 32.51,8.13 30.73,8.13 30.23,8.64 30.23,11.94 28.96,13.21 25.65,13.21 24.38,11.94 18.8,11.94 | 32.51,8.13 35.05,8.13 | 76.2,13.21 73.41,13.21 | 73.41,13.21 69.85,13.21 | 105.66,8.13 100.33,8.13 98.68,9.78 C14.1 94.49,13.21 93.22,11.94 89.66,11.94 | 41.91,12.7 41.91,11.94 41.15,11.18 41.15,9.65 v40.39,8.89 39.62,8.13 35.05,8.13 | 41.91,12.7 41.91,15.75 41.02,15.75 C50.1 | 11.43,29.46 10.16,29.46 8.64,29.46 C24.1 | 69.85,50.24 73.88,50.24 75.78,50.24 77.22,51.68 | v69.85,57.91 69.85,50.24 | 62.39,51.82 63.97,50.24 66.8,50.24 69.85,50.24 | 62.39,51.82 59.18,51.82 59.69,51.31 C21.1 | 93.47,51.31 94.23,51.31 | 94.23,51.31 97.16,51.31 96.77,50.93 C43.1 | 90.63,55.83 v92.71,57.91 | 89.41,93.22 v86.11,96.52 | 89.41,93.22 89.41,90.68 | 89.41,90.68 89.41,89.66 87.63,87.88 87.63,85.34 88.73,84.24 91.09,84.24 | 69.85,84.24 66.55,84.24 63.34,84.24 62.23,85.34 60.96,85.34 | 77.72,85.6 80.77,85.6 80.26,85.09 C49.1
  Top 1.016: 77.72,85.6 76.36,84.24 73.66,84.24 69.85,84.24 | 60.96,85.34 58.42,85.34 58.17,85.09 C23.1 | 128.27,47.5 133.1,47.5 v133.35,47.75 | 128.27,47.5 125.48,47.5 | 125.48,47.5 122.68,47.5 | 124.97,64.77 122.94,64.77 121.79,63.63 | 124.97,64.77 127.76,64.77 | 127.76,64.77 v133.35,64.77 | 121.54,80.64 122.68,81.79 124.97,81.79 | v133.35,81.79 128.02,81.79 | 128.02,81.79 124.97,81.79 | v129.54,34.04 129.54,29.46 | 134.62,106.93 133.35,108.2 v133.35,109.22 134.62,110.49 134.62,116.08 | 134.62,116.08 134.62,119.38 133.99,119.38 C37.1 | 117.35,106.93 116.33,107.95 v116.33,109.22 117.6,110.49 117.6,116.08 | 117.6,116.08 117.6,119.38 116.97,119.38 C33.1 | 118.62,129.54 120.14,131.06 v120.9,131.06 122.43,129.54 128.02,129.54 | 128.02,129.54 131.32,129.54 130.81,130.05 C2.1 | 73.91,118.33 76.71,118.33 78.01,119.63 78.74,119.63 | 73.82,118.24 70.87,118.24 69.47,119.63 67.56,119.63 | 98.55,123.95 98.55,120.9 95.98,118.33 90.64,118.33 88.14,118.33 88.14,118.36 86.87,119.63 81.28,119.63 | 98.55,123.95 98.55,127 98.93,127 C4.1 | 32.52,50.8 29.72,50.8 28.95,51.56 28.19,51.56 | 6.89,50.55 7.87,50.55 8.89,51.56 9.65,51.56 | v10.41,32.51 10.41,29.72 | 39.24,84.24 32.75,84.24 29.72,84.24 28.36,85.6 27.69,85.6 | 6.76,118.24 8.13,118.24 9.53,119.63 14.48,119.63 | 47.75,119.63 44.32,119.63 42.93,118.24 41.48,118.24 37.34,118.24 35.94,119.63 35.05,119.63 34.8,119.63 | 47.75,119.63 50.55,119.63 | 50.55,119.63 52.2,119.63 53.59,118.24 56.64,118.24 59.44,118.24 60.83,119.63 64.77,119.63 | 64.77,119.63 67.56,119.63 | 78.74,119.63 81.28,119.63 | 23.11,51.56 22.35,50.8 20.07,50.8 16.26,50.8 15.49,51.56 14.22,51.56
  Top 1.016: 25.65,51.56 23.11,51.56 | 25.65,51.56 28.19,51.56 | 9.65,51.56 12.19,51.56 | 12.19,51.56 13.72,51.56 | 13.72,51.56 14.22,51.56 | v14.22,58.17 14.22,52.07 13.72,51.56 | 19.65,85.6 18.29,84.24 17.04,84.24 12.79,84.24 11.43,85.6 | 19.65,85.6 22.61,85.6 | 22.61,85.6 25.15,85.6 | 25.15,85.6 27.69,85.6 | 19.65,85.6 21.08,87.03 v21.08,91.69 14.2,98.57 C65.1 | 11.43,85.6 7.87,85.6 7.87,85.47 C59.1 | 98.55,123.95 99.18,123.95 C36.1 | 128.02,129.54 C34.1 | 134.62,116.08 C5.1 | 117.6,116.08 C1.1 | 124.97,81.79 C6.1 | 128.02,81.79 128.02,82.67 C38.1 | 124.97,64.77 C39.1 | 127.76,64.77 C7.1 | 125.48,47.5 C8.1 | 128.27,47.5 C40.1 | 130.56,29.46 C42.1 | 81.28,119.63 81.53,119.38 C3.1 | 78.74,119.63 C35.1 | 64.77,119.63 C41.1 | 67.56,119.63 C9.1 | 47.75,119.63 C47.1 | 50.55,119.63 C15.1 | 32.26,119.63 26.8,119.63 25.4,118.24 23.5,118.24 19.68,118.24 18.29,119.63 17.02,119.63 | 34.8,119.63 32.26,119.63 | 32.26,119.63 C60.1 | 34.8,119.63 C28.1 | 17.02,119.63 14.48,119.63 | C61.1 17.02,119.63 | C29.1 14.48,119.63 | C27.1 10.92,85.09 11.43,85.6 | C26.1 20.07,85.18 19.65,85.6 | C58.1 22.61,85.6 | C57.1 25.15,85.6 | C25.1 27.69,85.6 | C30.1 28.19,51.56 | C62.1 25.65,51.56 | C31.1 23.11,51.56 | C63.1 14.73,51.05 14.22,51.56 | C64.1 12.19,51.56 | C32.1 9.65,51.56 | C56.1 11.43,29.46 | C52.1 32.51,8.13 | C20.1 35.05,8.13 | C18.1 41.91,12.7 | C54.1 45.47,29.34 45.47,30.23 | C48.1 73.41,14.09 73.41,13.21 | C16.1 76.2,14.09 76.2,13.21 | C11.1 94.23,51.31 | C19.1 79.76,51.31 80.26,51.82 77.35,51.82 77.22,51.68 | C51.1 77.22,51.68 | C53.1 62.23,51.65 62.39,51.82 | v69.85,91.95 69.85,84.24 | C17.1 77.72,85.6 | C55.1 60.96,85.34 | C45.1 88.52,90.68 89.41,90.68 | C13.1 89.41,93.22 | D1.C 33.78,133.1
  Top 1.27: v43.69,32.51 43.69,30.23 | 69.85,13.21 v69.34,13.72 | C46.1 C14.1 | C12.1 C44.1 | v107.19,9.65 105.66,8.13 | C65.1 14.61,98.57 IC1.3
  Top 1.905: 35.05,119.63 35.05,130.62 D1.C
  Top 2.54: v84.58,113.28 v84.58,133.1 D1.C
  Bottom 2.032: v69.85,91.95 81.53,91.95 | v92.71,57.91 v69.85,57.91
  Bottom 2.54: v84.58,133.1 101.85,133.1 104.14,130.81 120.65,130.81 v120.9,131.06 122.68,129.29 122.68,110.49 | 122.68,110.49 122.68,83.57 | 122.68,83.57 122.68,66.55 | 122.68,66.55 122.68,49.78 | 122.68,49.78 122.68,40.89 v129.54,34.04 129.54,28.7 134.11,24.13 134.11,19.05 130.05,14.99 108.71,14.99 | v133.35,64.77 131.57,66.55 122.68,66.55 | 122.68,49.78 131.32,49.78 v133.35,47.75 | v133.35,81.79 131.57,83.57 122.68,83.57 | v116.33,109.22 117.6,110.49 122.68,110.49 | v133.35,109.22 123.95,109.22 122.68,110.49 | v84.58,113.28 84.58,101.35 86.11,99.82 v86.11,96.52 81.53,91.95 85.6,87.88 85.6,65.02 v92.71,57.91 | v107.19,9.65 107.19,13.46 108.71,14.99 | 70.61,14.99 v69.34,13.72 | 108.71,14.99 70.61,14.99 | 50.55,14.99 42.16,14.99 40.39,13.21 v40.39,8.89 34.04,8.89 27.43,15.49 9.14,15.49 6.1,18.54 6.1,28.19 v10.41,32.51 14.22,36.32 v14.22,58.17 17.27,61.21 17.27,80.01 | 50.55,14.99 70.61,14.99 | v43.69,32.51 43.69,29.21 50.55,22.35 50.55,14.99 | v21.08,91.69 17.27,87.88 17.27,80.01 | v35.05,124.46 27.94,117.35 7.62,117.35 3.85,113.57 3.85,87.85 8.38,83.31 13.97,83.31 17.27,80.01 | D1.C v32.64,133.1
AREF
  Top 0.508: SVO3.8 SVI3.8
GND  (via drill 0 pad 0, 0.35 pad 3, 1 pad 3)
  Top 0.762: U3.3 74.53,116.69 74.68,116.84 77.85,116.84 C35.2 | U16.3 85.72,25.02 85.88,25.17 87.62,25.17 87.64,25.15 88.39,25.15 88.39,20.83 87.79,20.22 86.06,20.22 84.38,18.54 82.04,18.54 80.52,17.02 76.08,17.02 C16.2
  Top 1.016: v69.6,42.93 70,43.33 70,48 | 64,48.64 62.48,48.64 C53.2 63.67,48.38 63.99,48.71 67.06,48.71 | C51.2 76.33,48.13 75.75,48.71 75,48.71 | C31.2 22.48,48.77 21.78,48.77 | 21.78,48.77 21.38,49.17 20.02,49.17 19.62,48.77 19.56,48.77 | C31.2 22.42,48.13 21.78,48.77 | C31.2 C30.2 28.83,48.77 29.52,48.77 29.93,49.17 32.55,49.17 32.96,48.77 33.27,48.77 | C32.2 8.76,48.77 8.12,48.77 7.94,48.94 6.59,48.94 6.41,48.77 5.84,48.77 | 33.02,82.55 32.63,82.55 32.54,82.64 28.16,82.64 C25.2 | C26.2 18.55,82.17 18.08,82.64 12.92,82.64 12.45,82.17 C27.2 | 90.42,48.51 91.1,48.51 91.22,48.64 93.47,48.64 C11.2 | C17.2 77.35,81.91 76.62,82.64 74.47,82.64 74.39,82.55 73.91,82.55 | C63.2 14.73,48.01 15.59,48.86 15.9,48.86
  Top 1.27: SVI3.7 SVO3.7 | SVI7.35 SVI7.36 | SVO4.2 SVI4.2 | SVO4.3 SVI4.3 | U$45.P1 61.5,101.82 v61.72,101.6 | U$21.P1 96.31,43.69 v98.04,43.69
  other vias: 77.98,24.38 66.55,26.16 33.02,15.49 103.89,20.57 115.82,41.66 37.34,25.4 19.05,126.49 53.09,139.19 80.77,109.22 14.22,19.3 45.72,39.62 69.85,74.93 90.17,74.17 24.64,41.4 33.02,112.01 21.59,75.18 58.52,92.01 9.91,100.58 115.32,74.93 39.62,58.42 31.75,61.98 13.72,62.74 4.32,63.25 25.15,92.2 66.55,95.5 74.17,88.9 91.44,94.23 36.32,91.19 41.91,91.69 50.04,125.73 66.8,125.73 80.01,125.98 38.1,130.05
  pour Top: 2.5,7.5 2.5,142.5 137.5,142.5 137.5,7.5
  pour Top: 3,8 3,142 137,142 137,8
  pour Bottom: 2.5,7.5 2.5,142.5 137.5,142.5 137.5,7.5
  pour Bottom: 3,8 3,142 137,142 137,8
IOREF
  Top 0.508: SVI4.7 SVO4.7
N$1  (via drill 0.35 pad 3)
  Top 1.016: 20.83,133.1 D1.A 19.61,133.1
  Top 2.54: PWR_IN.1 19.61,133.1 20.83,133.1 v22.35,133.1
N$4
  Top 1.27: VIN_ENABLE.1 32.84,98.33 24.02,98.33 C66.1 23.71,98.4 IC1.1
PA0
  Top 0.508: SVI2.1 SVO2.1
PA1
  Top 0.508: SVO2.2 SVI2.2
PA2
  Top 0.508: SVI2.3 SVO2.3
PA3
  Top 0.508: SVO2.4 SVI2.4
PA4
  Top 0.508: SVI2.5 SVO2.5
PA5
  Top 0.508: SVO2.6 SVI2.6
PA6
  Top 0.508: SVI2.7 SVO2.7 109.73,85.6 110.49,84.84 116.51,84.84 119.51,87.84 U1.4
PA7
  Top 0.508: SVI2.8 SVO2.8 108.62,88.14 110.91,85.85 116.08,85.85 116.97,86.73 U1.2
PA8
  Top 0.508: SVI3.1 SVO3.1 107.7,92.2 109.22,93.73 109.22,95 109.98,95.76 109.98,117.01 107.44,119.55 107.44,126.75 108.33,127.64 U2.4
PA9
  Top 0.508: SVI3.2 SVO3.2 107.49,94.74 108.97,96.31 108.97,116.59 106.43,119.13 106.43,128.11 108.49,130.18 U2.2
PA10
  Top 0.508: SVO3.3 SVI3.3 100.41,97.28 97.74,99.95 92.37,99.95 91.35,100.97 83.1,100.97 81.95,102.11 76.29,102.11 73.25,105.14 U3.2
PA11
  Top 0.508: SVO3.4 SVI3.4 99.31,99.82 98.16,100.97 92.79,100.97 91.77,101.98 83.52,101.98 82.38,103.12 76.71,103.12 75.8,104.04 U3.4
PA12
  Top 0.508: SVO3.5 SVI3.5 100.45,102.36 100.08,101.98 93.21,101.98 90.27,104.92 U4.2
PA13
  Top 0.508: SVO3.6 SVI3.6 99.31,104.9 97.41,103 93.63,103 92.81,103.81 U4.4
PA14
  Top 0.508: SVI1.8 SVO1.8 107.95,65.28 108.97,66.29 108.97,80.25 112.53,83.82 116.93,83.82 125.56,92.46 129.89,92.46 133.99,96.55 U5.2
PA15
  Top 0.508: SVI1.7 SVO1.7 107.42,62.74 109.98,65.3 109.98,79.83 112.95,82.8 117.35,82.8 125.98,91.44 131.41,91.44 136.53,96.55 U5.4
PA16
  Top 0.508: SVI1.6 SVO1.6 108.97,60.2 108.97,62.74 111.25,65.02 113.79,65.02 115.57,66.8 119.63,66.8 120.27,67.44 U6.2
PA17
  Top 0.508: SVI1.5 SVO1.5 108.97,57.66 109.98,58.67 109.98,62.23 111.76,64.01 114.3,64.01 116.08,65.79 121.92,65.79 122.81,66.67 U6.4
PA18
  Top 0.508: SVI1.4 SVO1.4 107.67,55.12 112.24,50.55 119.22,50.55 120.57,51.89 120.57,55.7 U7.2
PA19
  Top 0.508: SVI1.3 SVO1.3 107.75,52.58 110.8,49.53 121.51,49.53 123.11,51.13 123.11,55.7 U7.4
PA20
  Top 0.508: SVI1.2 SVO1.2 107.52,49.2 108.33,49.2 109.73,47.8 109.73,43.31 116.11,36.93 119.98,36.93 120.27,37.21 U8.2
PA21
  Top 0.508: SVI1.1 SVO1.1 108.71,45.42 108.71,42.89 115.69,35.91 121.09,35.91 122.81,37.62 U8.4
PA22
  Top 0.508: SVI7.3 101.85,41.91 101.85,44.66 99.57,46.95 99.57,90.08 99.55,90.08 98.81,90.83 98.81,97.45 97.31,98.93 91.95,98.93 90.93,99.95 82.68,99.95 81.53,101.09 66.97,101.09 66.04,102.02 66.04,106.34 63.41,108.97 59.6,108.97 58.6,109.97 U9.4
PA23
  Top 0.508: U10.2 121.33,23.19 121.33,22.18 120.59,21.43 119.44,21.43 118.87,22 118.87,23.62 114.55,27.94 101.35,27.94 98.04,31.24 98.04,34.04 99.82,35.81 SVI7.4
PA24
  Top 0.508: SVI7.5 98.98,41.58 100.09,41.58 100.84,42.33 100.84,44.24 98.55,46.52 98.55,89.41 97.79,90.17 97.79,96.52 97.79,97 | U9.2 56.06,111.07 59.18,107.95 62.99,107.95 65.02,105.92 65.02,101.6 66.55,100.08 81.03,100.08 82.17,98.93 90.51,98.93 91.53,97.92 96.87,97.92 97.79,97 | 97.79,97.02 97.79,97
PA25
  Top 0.508: U10.4 123.83,21.46 122.78,20.42 119.02,20.42 117.86,21.58 117.86,22.95 113.88,26.92 100.92,26.92 97.03,30.82 97.03,37.08 SVI7.6
PA26
  Top 0.508: U11.4 91.9,42.72 SVI7.7
PA27
  Top 0.508: U12.2 121.8,17.9 120.3,19.4 118.6,19.4 116.84,21.16 116.84,22.35 113.28,25.91 100.5,25.91 96.01,30.4 96.01,36.07 SVI7.8
PA28
  Top 0.508: U11.2 89.36,42.72 SVI7.9
PA29
  Top 0.508: U12.4 119.26,17.38 118.26,18.38 118.18,18.38 115.82,20.74 115.82,21.84 112.78,24.89 100.08,24.89 95,29.98 95,34.8 94.16,35.64 93.9,35.64 SVI7.10
PA30
  Top 0.508: SVI7.11 86.61,42.93 86.61,76.29 88.05,77.72 91.95,77.72 93.17,78.94 U13.4
PA31
  Top 0.457: SVI7.12 89.83,37.34 91.51,35.66 92.48,35.66 93.98,34.16
  Top 0.508: U14.2 90.33,16.73 91.13,17.53 92.46,17.53 93.22,18.29 93.22,22.61 93.98,23.37 93.98,34.16
PA32
  Top 0.508: SVI7.13 85.6,41.4 85.6,76.71 87.63,78.74 90.42,78.74 90.63,78.94 U13.2
PA33
  Top 0.457: SVI7.14 87.29,37.34 88.97,35.66 90.14,35.66 91.11,34.7 91.8,34.7 92.96,33.53
  Top 0.508: U14.4 87.79,16.73 88.49,17.43 89.59,17.43 90.71,18.54 92.03,18.54 92.2,18.71 92.2,23.03 92.96,23.79 92.96,33.53
PA34
  Top 0.508: SVI7.15 84.58,73.91 83.22,75.26 83.22,96.43 80.6,99.06 60.11,99.06 58.42,100.75 58.42,107.14 56.09,109.47 43.43,109.47 41.84,111.06 U15.4
PA35
  Top 0.508: U16.2 84.45,21.72 84.17,21.43 82.51,21.43 82.01,21.93 82.01,29.24 81.21,30.04 81.21,33.96 SVI7.16
PA36
  Top 0.508: SVI7.17 82.04,40.64 83.57,42.16 83.57,73.49 82.21,74.84 82.21,96.01 80.18,98.04 59.69,98.04 57.4,100.33 57.4,106.72 55.67,108.46 43.01,108.46 39.3,112.17 U15.2
PA37
  Top 0.508: SVI7.18 80.19,35.49 80.19,29.62 81,28.82 81,21.51 82.33,20.17 84.34,20.17 85.47,21.3 85.6,21.43 86.3,21.43 87,22.13 U16.4
PA38
  Top 0.508: SVI7.19 82.55,42.93 82.55,73.06 80.43,75.18 77.72,75.18 75.15,77.76 U17.4
PA39
  Top 0.508: SVI7.20 79.18,37.01 79.18,29.65 64.51,14.99 57.66,14.99 56.31,16.33 54.18,16.33 53.72,15.88 U18.2
PA40
  Top 0.508: SVI7.21 78.74,41.66 79.84,41.66 81.53,43.35 81.53,72.64 80.01,74.17 77.3,74.17 72.61,78.86 U17.2
PA41
  Top 0.508: U18.4 51.18,16.13 52.4,17.35 56.73,17.35 58.08,16 64.09,16 78.16,30.07 78.16,36.14 SVI7.22
PA42
  Top 0.508: U19.4 75.15,40.61 SVI7.23
PA43
  Top 0.508: U20.2 19.21,16.93 19.81,17.53 22.61,17.53 23.37,16.76 29.12,16.76 31.75,19.39 31.75,19.81 33.27,21.34 39.37,21.34 40.39,20.32 40.39,19.64 43.01,17.02 46.9,17.02 48.25,18.37 57.15,18.37 58.5,17.02 63.67,17.02 76.96,30.31 76.96,34.8 SVI7.24
PA44
  Top 0.508: U19.2 72.61,45.24 73.91,43.94 73.91,41.91 SVI7.25
PA45
  Top 0.508: U20.4 16.67,16.93 18.29,18.54 23.03,18.54 23.79,17.78 28.7,17.78 30.73,19.81 30.73,20.32 32.77,22.35 40.13,22.35 41.4,21.08 41.4,20.07 43.43,18.03 46.48,18.03 47.83,19.38 57.57,19.38 58.92,18.03 63.25,18.03 75.95,30.73 75.95,33.27 SVI7.26
PA46
  Top 0.508: U21.4 68.41,45.29 67.06,43.94 67.06,42.16 SVI7.27
PA47
  Top 0.508: U22.2 52.66,20.5 52.75,20.4 57.06,20.4 58.42,21.75 58.42,28.76 58.44,28.78 58.44,29.65 62.4,33.6 63.4,33.6 64.42,34.62 65.39,34.62 66.4,35.64 67.51,35.64 69.21,37.34 SVI7.28
PA48
  Top 0.508: U21.2 65.86,40.81 SVI7.29
PA49
  Top 0.508: U22.4 55.2,21.51 55.29,21.41 56.64,21.41 57.4,22.18 57.4,30.05 61.98,34.62 62.98,34.62 64,35.64 64.97,35.64 66.67,37.34 SVI7.30
PA50
  Top 0.457: SVI7.31 62.59,41.55 61.41,41.55 60.45,42.52 59.59,42.52
  Top 0.508: U23.4 68.15,79.41 63.16,74.42 60.2,74.42 57.76,71.98 57.76,43.91 59.15,42.52 59.59,42.52
PA51
  Top 0.508: U24.2 18.03,22.7 18.03,21.34 19.3,20.07 22.01,20.07 23.11,21.17 23.11,22.1 24.64,23.62 30.39,23.62 36.83,30.06 36.83,33.53 38.65,35.35 56.94,35.35 57.74,34.54 60.37,34.54 61.46,35.64 62.56,35.64 SVI7.32
PA52
  Top 0.457: SVI7.33 60.05,41.55 58.67,41.55
  Top 0.508: U23.2 65.61,78.31 62.74,75.44 59.78,75.44 56.74,72.4 56.74,43.48 58.67,41.55
PA53
  Top 0.508: U24.4 20.54,21.38 20.83,21.08 21.59,21.08 22.1,21.59 22.1,22.61 24.13,24.64 29.97,24.64 35.81,30.48 35.81,33.95 38.23,36.37 57.36,36.37 58.17,35.56 59.94,35.56 SVI7.34
PA54
  Top 0.508: SVI5.8 SVO5.8 46.48,83.06 45.97,82.55 39.62,82.55 38.87,81.79 U25.2
PA55
  Top 0.508: SVI5.7 SVO5.7 46.74,80.52 45.97,81.28 42.11,81.28 U25.4
PA56
  Top 0.508: SVI5.6 SVO5.6 49.96,77.9 49.05,77.9 46.84,75.69 35.31,75.69 34.41,76.59 U26.4
PA57
  Top 0.508: SVI5.5 SVO5.5 49.96,75.36 48.39,75.36 47.71,74.68 33.53,74.68 31.86,76.34 U26.2
PA58
  Top 0.508: SVI5.4 SVO5.4 48.26,72.9 46.99,71.63 46.99,70.36 45.72,69.09 18.29,69.09 17.41,69.97 U27.4
PA59
  Top 0.508: SVI5.3 SVO5.3 48.43,70.36 46.14,68.07 16.51,68.07 14.87,69.72 U27.2
PA60
  Top 0.508: SVI5.2 SVO5.2 47.32,67.82 46.56,67.06 8.71,67.06 6.43,69.34 6.43,105.92 8.97,108.46 21.46,108.46 24.41,111.41 U28.4
PA61
  Top 0.508: SVI5.1 SVO5.1 47.05,65.28 46.29,66.04 8.21,66.04 5.41,68.83 5.41,106.34 8.55,109.47 19.84,109.47 21.86,111.5 U28.2
PA62
  Top 0.508: SVI6.8 SVO6.8 48.01,62.23 48.01,62.88 45.87,65.02 7.66,65.02 4.36,68.33 4.36,106.72 7.41,109.77 U29.4
PA63
  Top 0.508: SVI6.7 SVO6.7 48.26,57.66 46.99,58.93 46.99,62.46 45.45,64.01 7.15,64.01 3.34,67.82 3.34,107 3.34,107.14 4.87,108.67 U29.2
PA64
  Top 0.508: SVI6.6 SVO6.6 48.77,55.12 45.72,52.07 40.82,52.07 36.32,47.57 36.32,45.47 35.81,44.96 35.05,44.96 34.42,45.59 U30.4
PA65
  Top 0.508: SVI6.5 SVO6.5 47.66,52.58 46.14,51.05 41.24,51.05 37.34,47.15 37.34,43.18 36.07,41.91 32.77,41.91 31.88,42.8 U30.2
PA66
  Top 0.508: SVI6.4 SVO6.4 41.66,50.04 38.35,46.73 38.35,41.15 37.64,40.43 36.55,40.43 34.47,38.35 22.1,38.35 20.7,39.75 U31.4
PA67
  Top 0.508: SVI6.3 SVO6.3 48.13,47.5 46.6,49.02 42.08,49.02 39.37,46.31 39.37,40.3 38.48,39.41 36.97,39.41 34.89,37.34 20.32,37.34 18.16,39.5 U31.2
PA68
  Top 0.508: SVI6.2 SVO6.2 49.23,44.96 46.18,48.01 42.51,48.01 40.39,45.89 40.39,39.88 38.91,38.4 37.39,38.4 35.31,36.32 8.13,36.32 7.26,37.19 U32.4
PA69
  Top 0.508: SVI6.1 SVO6.1 48.26,42.42 47.5,43.18 47.5,45.21 45.72,46.99 42.93,46.99 41.66,45.72 41.66,39.71 39.33,37.38 37.81,37.38 35.73,35.31 6.6,35.31 4.72,37.19 U32.2
PD6
  Top 0.762: U1.5 119.51,121.03 117.86,122.68 112.68,122.68 U$3.P0
PD7
  Top 0.762: U1.7 116.97,104.8 116.26,105.5 U$4.P0
PD8
  Top 0.762: U2.5 133.22,127.64 134.62,129.03 134.62,134.38 U$5.P0
PD9
  Top 0.762: U2.7 116.97,130.18 117.6,130.81 117.6,134.4 U$6.P0
PD10
  Top 0.762: U3.7 73.25,128.12 74.68,129.54 78.46,129.54 U$8.P0
PD11
  Top 0.762: U3.5 75.8,121.52 76.78,122.5 U$7.P0
PD12
  Top 0.762: U4.7 90.27,127.86 91.95,129.54 95.46,129.54 U$10.P0
PD13
  Top 0.762: U4.5 92.81,121.77 93.73,122.68 95.32,122.68 U$9.P0
PD14
  Top 0.762: U5.7 133.99,105.03 133.35,105.66 129.66,105.66 U$2.P0
PD15
  Top 0.762: U5.5 136.53,120.27 134.29,122.5 U$1.P0
PD16
  Top 0.762: U6.7 120.27,79.65 119.4,80.52 114.52,80.52 U$12.P0
PD17
  Top 0.762: U6.5 122.81,79.38 123.44,80.01 127.99,80.01 U$11.P0
PD18
  Top 0.762: U7.7 120.44,61.68 120.44,62.97 119.88,63.53 118.14,63.53 116.08,61.47 112.53,61.47 U$14.P0
PD19
  Top 0.762: U7.5 123.06,62.61 123.7,63.25 127.75,63.25 U$13.P0
PD20
  Top 0.762: U8.7 120.27,46.1 119.38,46.99 114.99,46.99 U$16.P0
PD21
  Top 0.762: U8.5 122.81,45.59 123.19,45.97 128.03,45.97 U$15.P0
PD22
  Top 0.762: U9.5 58.6,121.59 59.51,122.5 U$17.P0
PD23
  Top 0.762: U$20.P0 119.39,32.5 121.28,30.61 U10.7
PD24
  Top 0.762: U9.7 56.06,127.94 57.66,129.54 61.46,129.54 U$18.P0
PD25
  Top 0.762: U10.5 123.83,31.82 U$19.P0
PD26
  Top 0.762: U11.5 91.9,53.8 92.71,54.61 95.39,54.61 U$21.P0
PD27
  Top 0.762: U$24.P0 129.1,10.9 122.41,10.9 121.79,10.29 U12.7
PD28
  Top 0.762: U11.7 89.36,54.15 88.14,55.37 88.14,57.91 91.73,61.5 U$22.P0
PD29
  Top 0.762: U12.5 118.5,8 115,8 U$23.P0
PD30
  Top 0.762: U13.5 93.17,87.33 94.34,88.5 U$25.P0
PD31
  Top 0.762: U14.7 90.41,9.7 90.41,8.41 90.98,7.84 92.84,7.84 U$28.P0
PD32
  Top 0.762: U13.7 90.63,88.09 95.5,92.96 U$26.P0
PD33
  Top 0.762: U$27.P0 80.67,8.51 81.3,7.87 87.12,7.87 87.79,8.54 U14.5
PD34
  Top 0.762: U15.5 41.84,121.6 42.74,122.5 U$29.P0
PD35
  Top 0.762: U16.7 84.45,31.55 U$32.P0
PD36
  Top 0.762: U15.7 39.3,127.95 40.89,129.54 44.46,129.54 U$30.P0
PD37
  Top 0.762: U16.5 87.14,31.26 88.39,32.51 90.49,32.51 U$31.P0
PD38
  Top 0.762: U17.5 75.15,87.6 76.05,88.5 U$33.P0
PD39
  Top 0.762: U18.7 53.72,10.2 54.44,10.92 61.08,10.92 U$36.P0
PD40
  Top 0.762: U17.7 72.61,89.61 U$34.P0
PD41
  Top 0.762: U18.5 51.18,7.87 47.24,7.87 U$35.P0
PD42
  Top 0.762: U19.5 75.15,53.56 76.2,54.61 78.39,54.61 U$37.P0
PD43
  Top 0.762: U20.7 19.21,8.47 19.82,7.87 24.86,7.87 U$40.P0
PD44
  Top 0.762: U19.7 72.61,55.61 U$38.P0
PD45
  Top 0.762: U$39.P0 12.73,8.38 13.23,7.87 16,7.87 16.67,8.54 U20.5
PD46
  Top 0.762: U21.5 68.41,54.59 U$41.P0
PD47
  Top 0.762: U$44.P0 51.4,30.77 52.27,30.77 52.7,30.33 U22.7
PD48
  Top 0.762: U21.7 65.86,53.77 65.13,54.5 U$42.P0
PD49
  Top 0.762: U22.5 55.24,31.25 U$43.P0
PD50
  Top 0.762: U23.5 68.15,88.31 61.5,94.96 U$45.P0
PD51
  Top 0.762: U24.7 18,30.27 15.76,32.5 U$48.P0
PD52
  Top 0.762: U23.7 65.61,88.31 65.28,88.65 61.65,88.65 U$46.P0
PD53
  Top 0.762: U24.5 20.54,30.54 U$47.P0
PD54
  Top 0.762: U25.7 38.87,93.36 41,95.5 U$50.P0
PD55
  Top 0.762: U25.5 41.41,87.41 42.5,88.5 U$49.P0
PD56
  Top 0.762: U26.5 34.41,93.09 32,95.5 U$51.P0
PD57
  Top 0.762: U26.7 31.86,87.71 31.22,88.36 31.14,88.36 31,88.5 U$52.P0
PD58
  Top 0.762: U27.5 17.41,93.09 15,95.5 U$53.P0
PD59
  Top 0.762: U27.7 14.87,87.71 14.22,88.36 14.14,88.36 14,88.5 U$54.P0
PD60
  Top 0.762: U28.5 24.41,121.91 25,122.5 U$55.P0
PD61
  Top 0.762: U28.7 21.86,121.95 24.41,124.49 24.41,127.61 26.29,129.5 U$56.P0
PD62
  Top 0.762: U29.5 7.41,121.91 8,122.5 U$57.P0
PD63
  Top 0.762: U29.7 4.87,127.36 7,129.5 U$58.P0
PD64
  Top 0.762: U30.5 34.42,53.98 35.31,54.86 44.14,54.86 U$59.P0
PD65
  Top 0.762: U30.7 31.88,59.31 34.07,61.5 U$60.P0
PD66
  Top 0.762: U31.5 20.7,53.47 22.1,54.86 27.14,54.86 U$61.P0
PD67
  Top 0.762: U31.7 18.16,59.05 20.83,61.72 27.28,61.72 U$62.P0
PD68
  Top 0.762: U32.5 7.26,54 8.13,54.86 10.59,54.86 U$63.P0
PD69
  Top 0.762: U32.7 4.72,59.59 6.65,61.52 U$64.P0
RESET
  Top 0.508: SVI4.6 SVO4.6 40.67,100.84 RESET.3 RESET.4
SCL
  Top 0.508: SVO3.10 SVI3.10
SDA
  Top 0.508: SVI3.9 SVO3.9
VIN
  Top 1.143: 47.24,89.56 47.24,97.03
  Top 1.27: SVI4.1 SVO4.1 48.67,88.14 47.24,89.56 | VIN_ENABLE.2 VIN_ENABLE.3 39.95,98.33 45.94,98.33 47.24,97.03

### Text on the board
NamesBottom: 19VDC | (7,8) | (3,8) | 61 | 12 | (8,8) | (6,8) | (5,8) | (4,8) | (2,8) | (1,8) | 63 | 36 | 24 | 10 | 09 | 08 | (8,7) | (7,7) | 62 | 60 | (2,7) | (6,7) | (5,7) | (4,7) | (3,7) | 06 | (1,7) | 34 | 22 | 11 | 13 | 15 | SCL | SDA | AREF | RESET | GND | 13 | IOREF | 12 | (7,6) | (5,6) | (4,6) | (3,6) | (2,6) | (1,6) | RESET | 56 | (6,6) | 50 | 40 | 32 | 11 | 07 | 14 | 3V3 | 54 | 5V | 10 | (8,6) | 9 | 58 | ON | OFF | GND | 8 | VIN_EN | GND | 7 | (1,5) | VIN | 6 | 17 | (7,5) | (6,5) | (5,5) | (4,5) | (3,5) | (2,5) | 54 | 5 | 57 | 55 | 52 | 38 | 30 | 16 | (8,5) | 55 | 4 | 59 | 56 | 3 | 57 | 2 | 58 | 1 | 59 | 0 | (1,4) | 19 | (8,4) | (7,4) | (6,4) | 60 | (5,4) | (4,4) | (3,4) | (2,4) | 69 | 67 | 65 | 61 | 46 | 44 | 28 | 14 | 18 | 15 | 62 | 16 | 63 | 17 | 64 | 18 | (1,3) | 65 | 19 | 21 | (8,3) | (7,3) | (6,3) | 66 | (5,3) | (4,3) | (3,3) | 20 | (2,3) | 68 | 66 | 64 | 48 | 42 | 26 | 20 | 67 | 21 | 68 | 69 | (8,2) | (6,2) | 51 | 47 | GND | 53 | 51 | 49 | 47 | 45 | 43 | 41 | 39 | 37 | 35 | 33 | 31 | 29 | 27 | 25 | 23 | 5V | (1,2) | 25 | (7,2) | (2,2) | (5,2) | (4,2) | (3,2) | 53 | 23 | 49 | 35 | 37 | (7,1) | (6,1) | (5,1) | (4,1) | (3,1) | (2,1) | (1,1) | 43 | 41 | 39 | 33 | 31 | 29 | 27 | (8,1) | 45
tDesc: github.com/victorsvi (victorsvi@gmail.com) | ULTRASONIC MATRIX | TOP LAYER
bDesc: github.com/victorsvi (victorsvi@gmail.com) | ULTRASONIC MATRIX | BOTTOM LAYER
Grid: 10 | 20 | 30 | 40 | 50 | 60 | 70 | 80 | 90 | 100 | 110 | 120 | 130 | X | X | Y | Y | 130 | 130 | 120 | 120 | 110 | 110 | 100 | 100 | 90 | 90 | 80 | 80 | 70 | 70 | 60 | 60 | 50 | 50 | 40 | 40 | 30 | 30 | 20 | 20 | 10 | 10 | Y | Y | 10 | 20 | 30 | 40 | 50 | 60 | 70 | 80 | 90 | 100 | 110 | 120 | 130 | X | X | github.com/victorsvi (victorsvi@gmail.com) | ULTRASONIC MATRIX
Grid2: 10 | 20 | 30 | 40 | 50 | 60 | 70 | 80 | 90 | 100 | 110 | 120 | 130 | X | X | Y | Y | 130 | 130 | 120 | 120 | 110 | 110 | 100 | 100 | 90 | 90 | 80 | 80 | 70 | 70 | 60 | 60 | 50 | 50 | 40 | 40 | 30 | 30 | 20 | 20 | 10 | 10 | Y | Y | 10 | 20 | 30 | 40 | 50 | 60 | 70 | 80 | 90 | 100 | 110 | 120 | 130 | X | X | github.com/victorsvi (victorsvi@gmail.com) | ULTRASONIC MATRIX